# Altium project myPLC.PrjPcb (part 1 of 2)
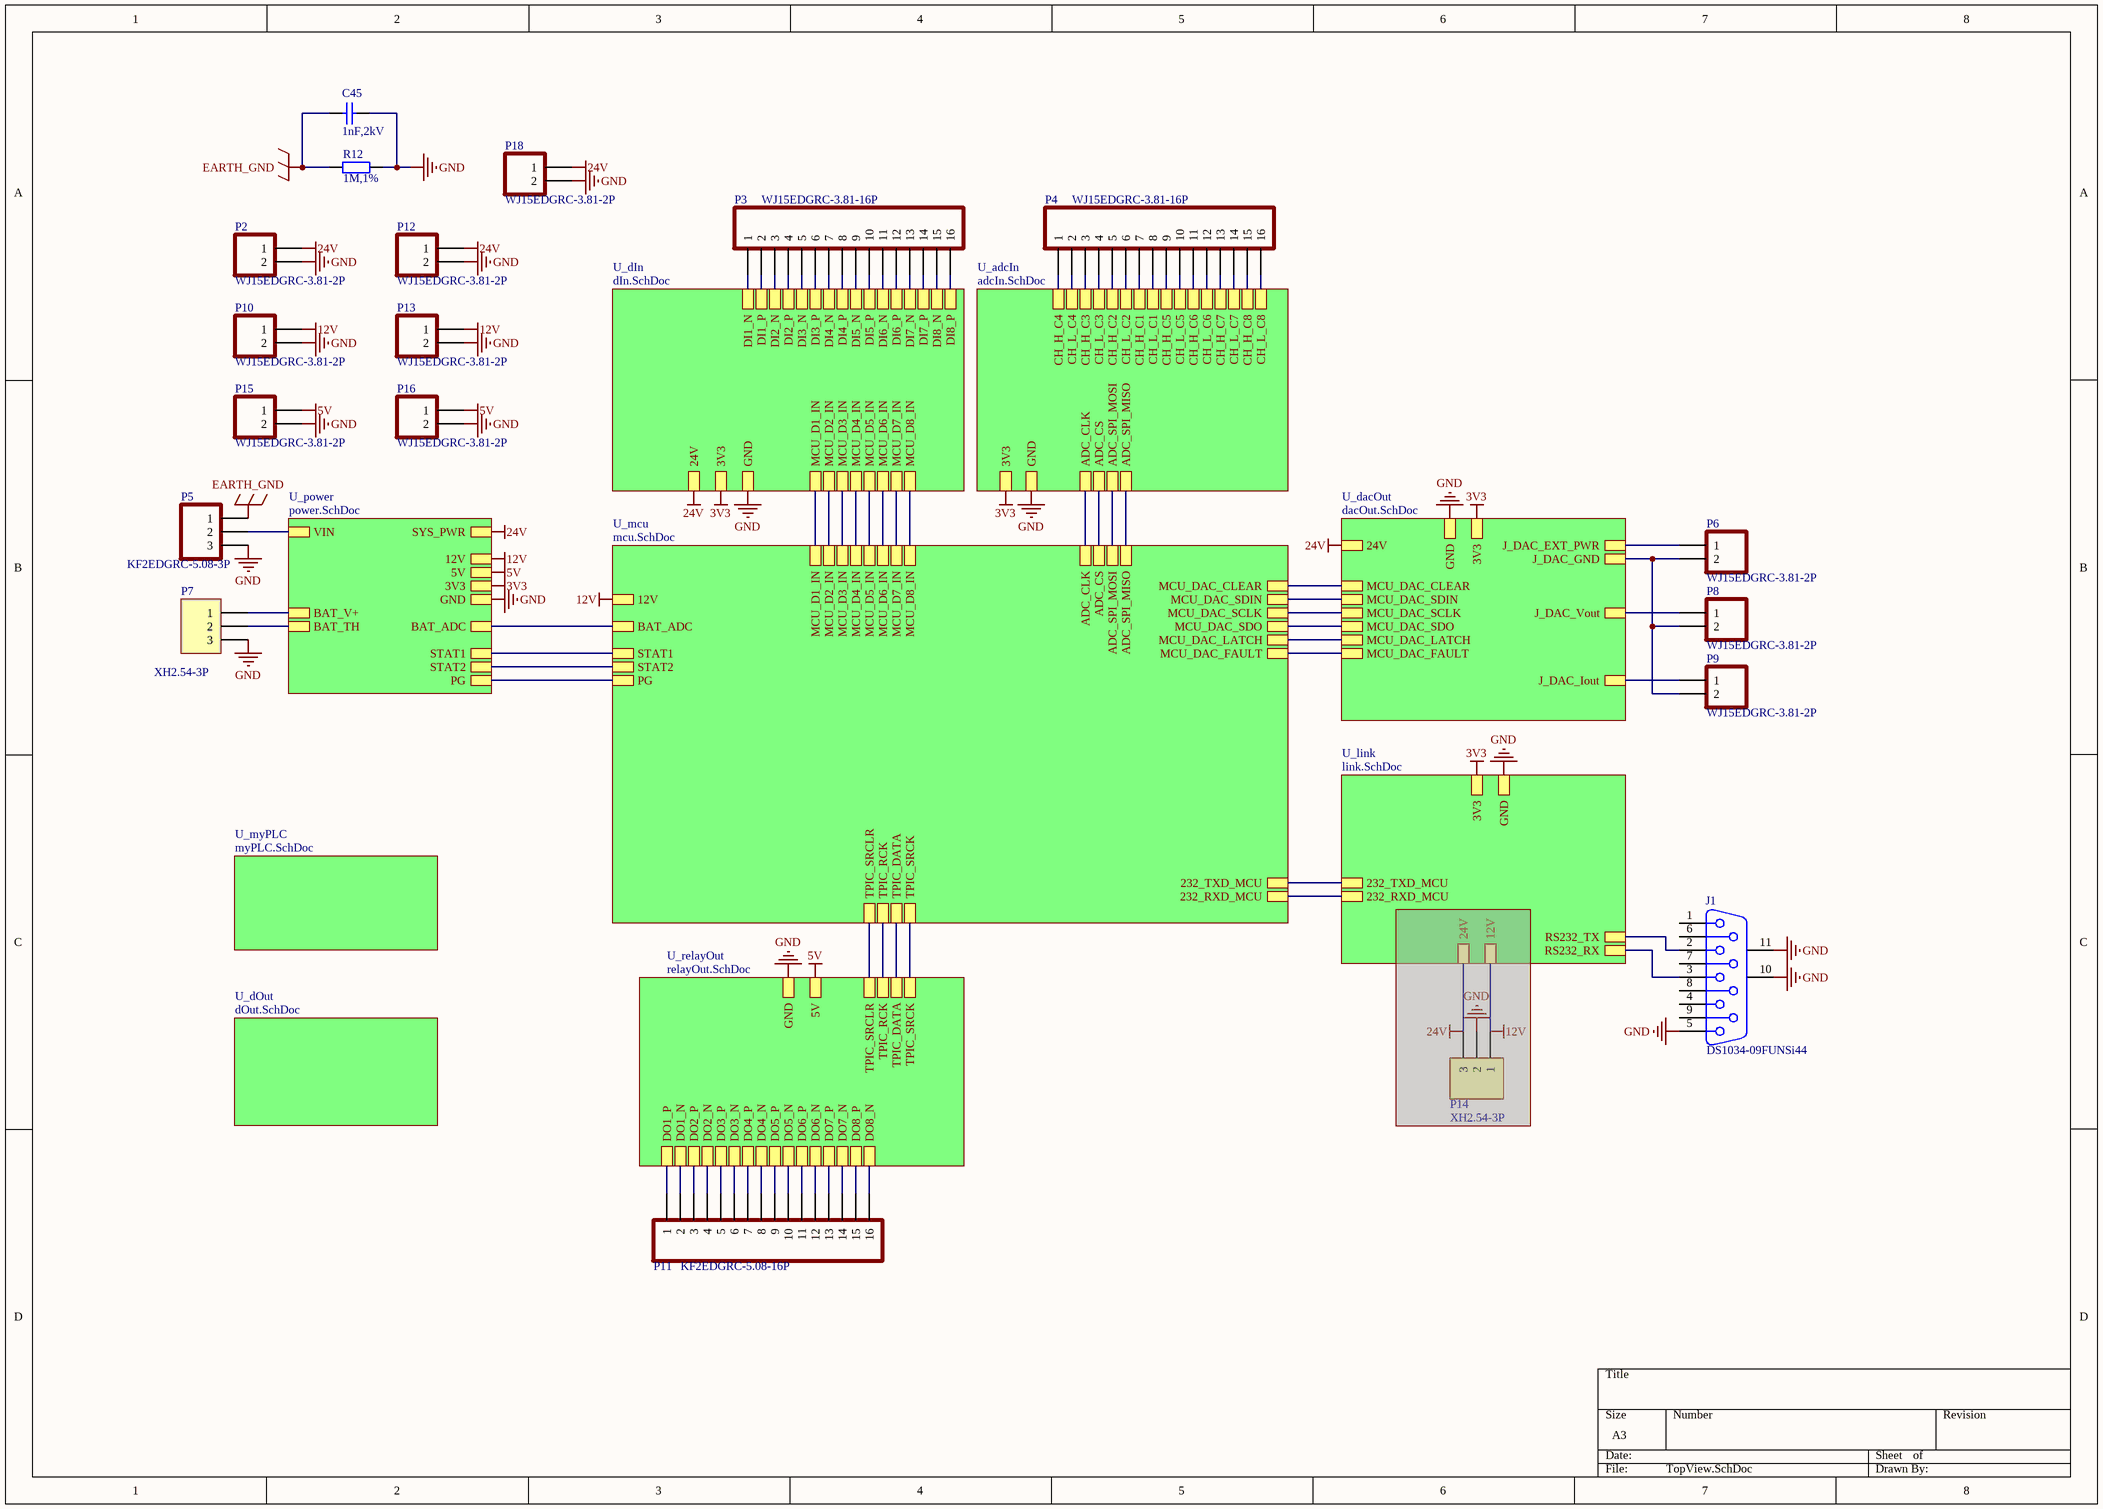
[diagram p0: TopView.SchDoc]
14 sheets, 401 parts. Net scope: hierarchical (ports join the sheet entries above them; power ports are global).
Board file: PCB1.PcbDoc
Sheets:
  TopView.SchDoc
    U_adcIn = adcIn.SchDoc
      A1 = subADCIn.SchDoc
      A2 = subADCIn.SchDoc
      A3 = subADCIn.SchDoc
      A4 = subADCIn.SchDoc
      A5 = subADCIn.SchDoc
      A6 = subADCIn.SchDoc
      A7 = subADCIn.SchDoc
      A8 = subADCIn.SchDoc
    U_dacOut = dacOut.SchDoc
      AOUT1 = subDACOut.SchDoc
    U_dIn = dIn.SchDoc
      DIN1 = subDIn.SchDoc
      DIN2 = subDIn.SchDoc
      DIN3 = subDIn.SchDoc
      DIN4 = subDIn.SchDoc
      DIN5 = subDIn.SchDoc
      DIN6 = subDIn.SchDoc
      DIN7 = subDIn.SchDoc
      DIN8 = subDIn.SchDoc
    U_dOut = dOut.SchDoc
    U_link = link.SchDoc
    U_mcu = mcu.SchDoc
    U_relayOut = relayOut.SchDoc
      DO1 = subRelayOut.SchDoc
      DO2 = subRelayOut.SchDoc
      DO3 = subRelayOut.SchDoc
      DO4 = subRelayOut.SchDoc
      DO5 = subRelayOut.SchDoc
      DO6 = subRelayOut.SchDoc
      DO7 = subRelayOut.SchDoc
      DO8 = subRelayOut.SchDoc
    U_myPLC = myPLC.SchDoc
    U_power = power.SchDoc

## Sheet TopView.SchDoc
size A3

### Parts
(Parts that share a designator on the sheet are numbered #1, #2 ... from top to bottom, then left to right.)
C45  1nF,2kV  [C1206]
J1#1  DS1034-09FUNSi44  [DSUB-TH_2-5747706-0]
P2#1  WJ15EDGRC-3.81-2P  [CONN-TH_2P-P3.81_WJ15EDGRC-3.81-2P]
P3  WJ15EDGRC-3.81-16P  [CONN-TH_16P-P3.81_WJ15EDGRC-3.81-16P]
P4  WJ15EDGRC-3.81-16P  [CONN-TH_16P-P3.81_WJ15EDGRC-3.81-16P]
P5  KF2EDGRC-5.08-3P  [CONN-TH_3P-P5.08_KF2EDGRC-5.08-3P]
P6  WJ15EDGRC-3.81-2P  [CONN-TH_2P-P3.81_WJ15EDGRC-3.81-2P]
P7  XH2.54-3P  [XH2.54-3P;弯角;]
P8  WJ15EDGRC-3.81-2P  [CONN-TH_2P-P3.81_WJ15EDGRC-3.81-2P]
P9  WJ15EDGRC-3.81-2P  [CONN-TH_2P-P3.81_WJ15EDGRC-3.81-2P]
P10  WJ15EDGRC-3.81-2P  [CONN-TH_2P-P3.81_WJ15EDGRC-3.81-2P]
P11  KF2EDGRC-5.08-16P  [CONN-TH_16P-P5.08_KF2EDGRC-5.08-16P]
P12  WJ15EDGRC-3.81-2P  [CONN-TH_2P-P3.81_WJ15EDGRC-3.81-2P]
P13  WJ15EDGRC-3.81-2P  [CONN-TH_2P-P3.81_WJ15EDGRC-3.81-2P]
P14#1  XH2.54-3P  [XH2.54-3P-直角]  (masked out: inside a compile mask, not in the netlist)
P15  WJ15EDGRC-3.81-2P  [CONN-TH_2P-P3.81_WJ15EDGRC-3.81-2P]
P16  WJ15EDGRC-3.81-2P  [CONN-TH_2P-P3.81_WJ15EDGRC-3.81-2P]
P18  WJ15EDGRC-3.81-2P  [CONN-TH_2P-P3.81_WJ15EDGRC-3.81-2P]
R12  1M,1%  [R1206]

### Sub-sheets
U_adcIn = adcIn.SchDoc: ADC_SPI_MISO, ADC_SPI_MOSI, ADC_CS, ADC_CLK, 3V3, GND, CH_L_C8, CH_L_C3, CH_L_C1, CH_H_C7, CH_H_C2, CH_H_C3, CH_L_C4, CH_L_C6, CH_L_C7, CH_L_C5, CH_H_C4, CH_H_C1, CH_H_C5, CH_H_C8, CH_L_C2, CH_H_C6
U_dacOut = dacOut.SchDoc: 24V, MCU_DAC_CLEAR, MCU_DAC_SDIN, MCU_DAC_SCLK, 3V3, J_DAC_Iout, J_DAC_Vout, MCU_DAC_SDO, J_DAC_GND, MCU_DAC_FAULT, J_DAC_EXT_PWR, MCU_DAC_LATCH, GND
U_dIn = dIn.SchDoc: MCU_D1_IN, MCU_D2_IN, MCU_D3_IN, MCU_D4_IN, MCU_D5_IN, MCU_D6_IN, MCU_D7_IN, MCU_D8_IN, GND, 24V, 3V3, DI1_N, DI1_P, DI2_N, DI2_P, DI3_N, DI3_P, DI4_N, DI4_P, DI5_N, DI5_P, DI6_N, DI6_P, DI7_N, DI7_P, DI8_N, DI8_P
U_dOut = dOut.SchDoc: no entries
U_link = link.SchDoc: GND, RS232_TX, RS232_RX, 232_TXD_MCU, 232_RXD_MCU, 3V3, 24V, 12V
U_mcu = mcu.SchDoc: ADC_SPI_MISO, ADC_SPI_MOSI, ADC_CS, ADC_CLK, MCU_D1_IN, MCU_D2_IN, MCU_D3_IN, MCU_D4_IN, MCU_D5_IN, MCU_D6_IN, MCU_D7_IN, MCU_D8_IN, TPIC_SRCLR, TPIC_RCK, TPIC_DATA, TPIC_SRCK, 232_TXD_MCU, 232_RXD_MCU, MCU_DAC_CLEAR, MCU_DAC_SDIN, MCU_DAC_SCLK, MCU_DAC_SDO, MCU_DAC_FAULT, MCU_DAC_LATCH, 12V, BAT_ADC, STAT1, STAT2, PG
U_myPLC = myPLC.SchDoc: no entries
U_power = power.SchDoc: GND, 12V, 5V, 3V3, VIN, BAT_V+, BAT_TH, BAT_ADC, SYS_PWR, STAT1, STAT2, PG
U_relayOut = relayOut.SchDoc: DO1_P, DO2_P, DO3_P, DO4_P, DO5_P, DO6_P, DO7_P, DO8_P, DO1_N, DO2_N, DO3_N, DO4_N, DO5_N, DO6_N, DO7_N, DO8_N, GND, 5V, TPIC_SRCLR, TPIC_RCK, TPIC_DATA, TPIC_SRCK

### Nets
3V3: sheet U_adcIn/3V3, sheet U_dacOut/3V3, sheet U_dIn/3V3, sheet U_link/3V3, sheet U_power/3V3
5V: P15.1 P16.1 ; sheet U_relayOut/5V, sheet U_power/5V
12V: P10.1 P13.1 ; sheet U_mcu/12V, sheet U_power/12V
24V: P2#1.1 P12.1 P18.1 ; sheet U_dacOut/24V, sheet U_dIn/24V, sheet U_power/SYS_PWR
EARTH_GND: C45.1 P5.1 R12.2
EXT_DAC_VCC: P6.1 ; sheet U_dacOut/J_DAC_EXT_PWR
GND: C45.2 J1#1.5 J1#1.10(MH1) J1#1.11(MH2) P2#1.2 P5.3 P7.3 P10.2 P12.2 P13.2 P15.2 P16.2 P18.2 R12.1 ; sheet U_adcIn/GND, sheet U_dacOut/GND, sheet U_dIn/GND, sheet U_link/GND, sheet U_relayOut/GND, sheet U_power/GND
ISO_DAC_GND: P6.2 P8.2 P9.2 ; sheet U_dacOut/J_DAC_GND
VIN: P5.2 ; sheet U_power/VIN
ADC1_IN0: sheet U_mcu/BAT_ADC, sheet U_power/BAT_ADC
ADC_CLK: sheet U_adcIn/ADC_CLK, sheet U_mcu/ADC_CLK
ADC_CS: sheet U_adcIn/ADC_CS, sheet U_mcu/ADC_CS
ADC_SPI_MISO: sheet U_adcIn/ADC_SPI_MISO, sheet U_mcu/ADC_SPI_MISO
ADC_SPI_MOSI: sheet U_adcIn/ADC_SPI_MOSI, sheet U_mcu/ADC_SPI_MOSI
CH_H_C1: P4.7 ; sheet U_adcIn/CH_H_C1
CH_H_C2: P4.5 ; sheet U_adcIn/CH_H_C2
CH_H_C3: P4.3 ; sheet U_adcIn/CH_H_C3
CH_H_C4: P4.1 ; sheet U_adcIn/CH_H_C4
CH_H_C5: P4.9 ; sheet U_adcIn/CH_H_C5
CH_H_C6: P4.11 ; sheet U_adcIn/CH_H_C6
CH_H_C7: P4.13 ; sheet U_adcIn/CH_H_C7
CH_H_C8: P4.15 ; sheet U_adcIn/CH_H_C8
CH_L_C1: P4.8 ; sheet U_adcIn/CH_L_C1
CH_L_C2: P4.6 ; sheet U_adcIn/CH_L_C2
CH_L_C3: P4.4 ; sheet U_adcIn/CH_L_C3
CH_L_C4: P4.2 ; sheet U_adcIn/CH_L_C4
CH_L_C5: P4.10 ; sheet U_adcIn/CH_L_C5
CH_L_C6: P4.12 ; sheet U_adcIn/CH_L_C6
CH_L_C7: P4.14 ; sheet U_adcIn/CH_L_C7
CH_L_C8: P4.16 ; sheet U_adcIn/CH_L_C8
D1_IN: sheet U_dIn/MCU_D1_IN, sheet U_mcu/MCU_D1_IN
D2_IN: sheet U_dIn/MCU_D2_IN, sheet U_mcu/MCU_D2_IN
D3_IN: sheet U_dIn/MCU_D3_IN, sheet U_mcu/MCU_D3_IN
D4_IN: sheet U_dIn/MCU_D4_IN, sheet U_mcu/MCU_D4_IN
D5_IN: sheet U_dIn/MCU_D5_IN, sheet U_mcu/MCU_D5_IN
D6_IN: sheet U_dIn/MCU_D6_IN, sheet U_mcu/MCU_D6_IN
D7_IN: sheet U_dIn/MCU_D7_IN, sheet U_mcu/MCU_D7_IN
D8_IN: sheet U_dIn/MCU_D8_IN, sheet U_mcu/MCU_D8_IN
DI_N1: P3.1 ; sheet U_dIn/DI1_N
DI_N2: P3.3 ; sheet U_dIn/DI2_N
DI_N3: P3.5 ; sheet U_dIn/DI3_N
DI_N4: P3.7 ; sheet U_dIn/DI4_N
DI_N5: P3.9 ; sheet U_dIn/DI5_N
DI_N6: P3.11 ; sheet U_dIn/DI6_N
DI_N7: P3.13 ; sheet U_dIn/DI7_N
DI_N8: P3.15 ; sheet U_dIn/DI8_N
DI_P1: P3.2 ; sheet U_dIn/DI1_P
DI_P2: P3.4 ; sheet U_dIn/DI2_P
DI_P3: P3.6 ; sheet U_dIn/DI3_P
DI_P4: P3.8 ; sheet U_dIn/DI4_P
DI_P5: P3.10 ; sheet U_dIn/DI5_P
DI_P6: P3.12 ; sheet U_dIn/DI6_P
DI_P7: P3.14 ; sheet U_dIn/DI7_P
DI_P8: P3.16 ; sheet U_dIn/DI8_P
DO_N1: P11.2 ; sheet U_relayOut/DO1_N
DO_N2: P11.4 ; sheet U_relayOut/DO2_N
DO_N3: P11.6 ; sheet U_relayOut/DO3_N
DO_N4: P11.8 ; sheet U_relayOut/DO4_N
DO_N5: P11.10 ; sheet U_relayOut/DO5_N
DO_N6: P11.12 ; sheet U_relayOut/DO6_N
DO_N7: P11.14 ; sheet U_relayOut/DO7_N
DO_N8: P11.16 ; sheet U_relayOut/DO8_N
DO_P1: P11.1 ; sheet U_relayOut/DO1_P
DO_P2: P11.3 ; sheet U_relayOut/DO2_P
DO_P3: P11.5 ; sheet U_relayOut/DO3_P
DO_P4: P11.7 ; sheet U_relayOut/DO4_P
DO_P5: P11.9 ; sheet U_relayOut/DO5_P
DO_P6: P11.11 ; sheet U_relayOut/DO6_P
DO_P7: P11.13 ; sheet U_relayOut/DO7_P
DO_P8: P11.15 ; sheet U_relayOut/DO8_P
PG: sheet U_mcu/PG, sheet U_power/PG
SPI2_MISO: sheet U_dacOut/MCU_DAC_SDO, sheet U_mcu/MCU_DAC_SDO
SPI2_MOSI: sheet U_dacOut/MCU_DAC_SDIN, sheet U_mcu/MCU_DAC_SDIN
SPI2_SCK: sheet U_dacOut/MCU_DAC_SCLK, sheet U_mcu/MCU_DAC_SCLK
STAT1: sheet U_mcu/STAT1, sheet U_power/STAT1
STAT2: sheet U_mcu/STAT2, sheet U_power/STAT2
TPIC_DATA: sheet U_mcu/TPIC_DATA, sheet U_relayOut/TPIC_DATA
TPIC_RCK: sheet U_mcu/TPIC_RCK, sheet U_relayOut/TPIC_RCK
TPIC_SRCK: sheet U_mcu/TPIC_SRCK, sheet U_relayOut/TPIC_SRCK
TPIC_SRCLR: sheet U_mcu/TPIC_SRCLR, sheet U_relayOut/TPIC_SRCLR
USART2_RX: sheet U_link/232_RXD_MCU, sheet U_mcu/232_RXD_MCU
USART2_TX: sheet U_link/232_TXD_MCU, sheet U_mcu/232_TXD_MCU
NetC69_1: P7.1 ; sheet U_power/BAT_V+
NetD14_2: P8.1 ; sheet U_dacOut/J_DAC_Vout
NetD16_2: P9.1 ; sheet U_dacOut/J_DAC_Iout
NetJ1#1_2: J1#1.2 ; sheet U_link/RS232_TX
NetJ1#1_3: J1#1.3 ; sheet U_link/RS232_RX
NetP7_2: P7.2 ; sheet U_power/BAT_TH
NetU2_95: sheet U_dacOut/MCU_DAC_LATCH, sheet U_mcu/MCU_DAC_LATCH
NetU2_96: sheet U_dacOut/MCU_DAC_CLEAR, sheet U_mcu/MCU_DAC_CLEAR
NetU2_97: sheet U_dacOut/MCU_DAC_FAULT, sheet U_mcu/MCU_DAC_FAULT

Not connected (* = marked no-connect by the designer): J1#1 1 4 6 7 8 9

### Library data of the parts
C45 = 无极电容: Value: 104, 16V; Type: 贴片电容
J1#1 = D Connector 9: Receptacle Assembly, 9 Position, Right Angle; PackageDocument: O; Positions: 9; Published: 15-Jun-2001; LatestRevisionDate: 17-Jul-2002; LatestRevisionNote: Re-released for DXP Platform.; DatasheetDocument: 1-Sep-1999; PackageReference: 788750; Publisher: Altium Limited; Orientation: Right Angle; Gender: Receptacle
P5 = WJ15EDGRC-3.81-3P: LatestRevisionNote: Re-released for DXP Platform.
P7 = Header 3: Header, 3-Pin; LatestRevisionDate: 17-Jul-2002; LatestRevisionNote: Re-released for DXP Platform.; Publisher: Altium Limited
P11 = WJ15EDGRC-3.81-16P: LatestRevisionNote: Re-released for DXP Platform.
P14#1 = C3-3Pin: C3连接器插座, 3-Pin; name: C3连接器
R12 = 电阻: Value: 3.3K, 10%; Type: 贴片电阻
P2#1 P6 P8-P10 P12 P13 P15 P16 P18 = WJ15EDGRC-3.81-2P: LatestRevisionNote: Re-released for DXP Platform.
P3 P4 = WJ15EDGRC-3.81-16P: LatestRevisionNote: Re-released for DXP Platform.

## Sheet adcIn.SchDoc
size A4
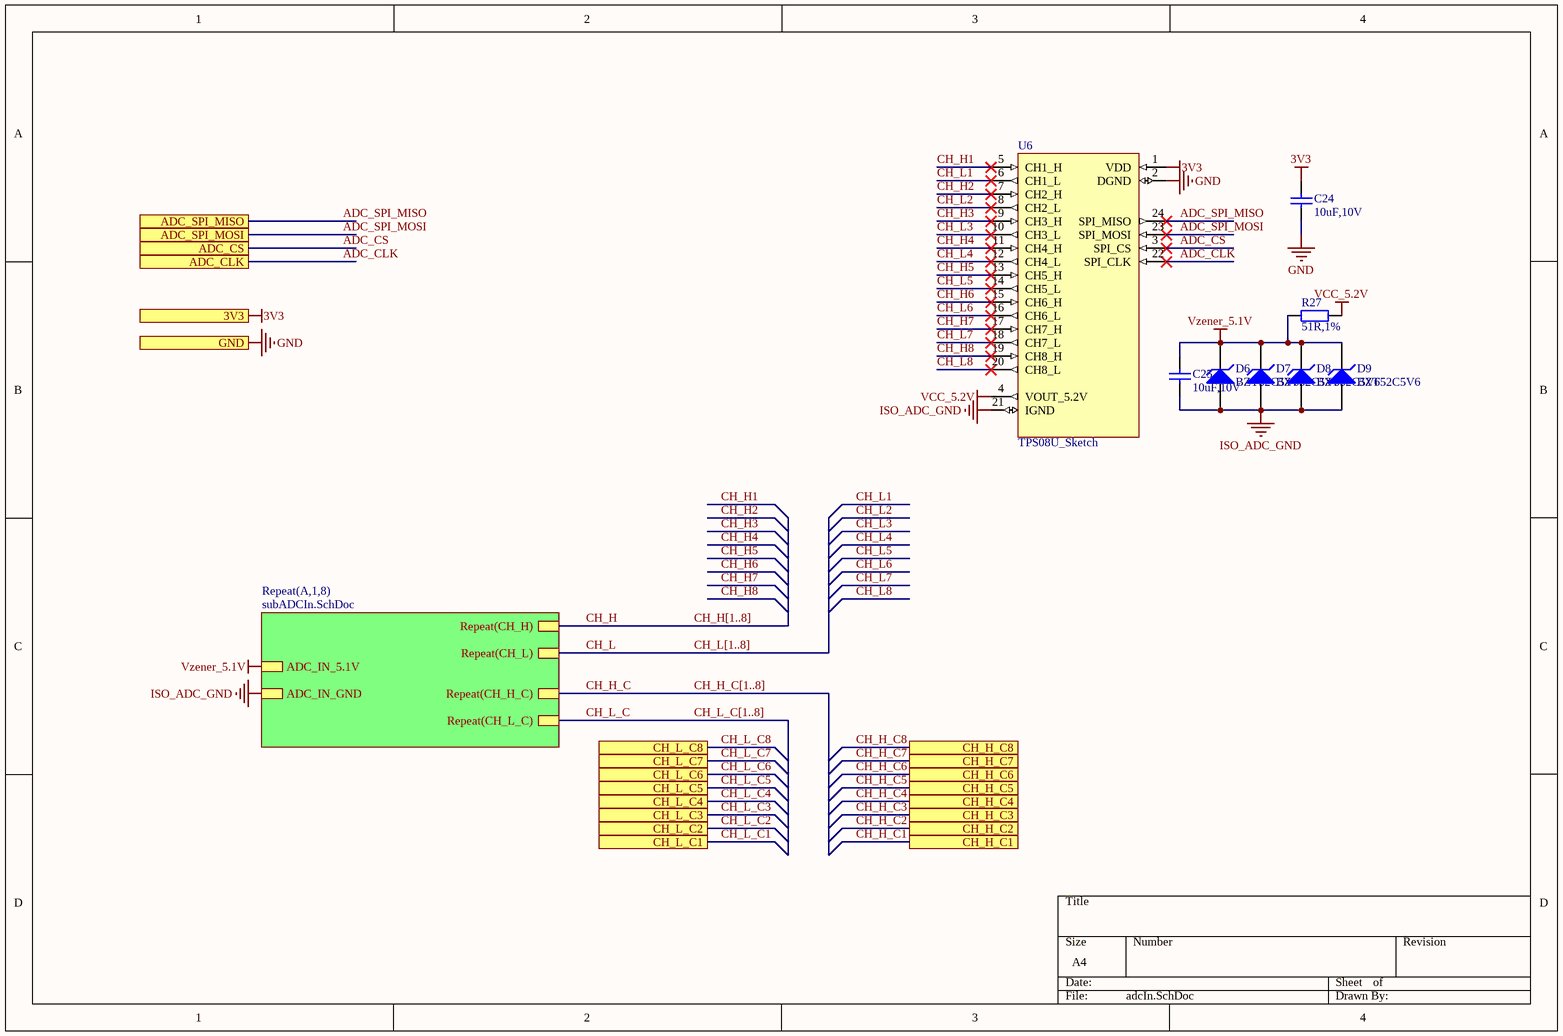
[diagram p1: adcIn.SchDoc]

### Parts
(Parts that share a designator on the sheet are numbered #1, #2 ... from top to bottom, then left to right.)
C24  10uF,10V  [C0603]
C25  10uF,10V  [C0603]
D6  BZT52C5V6  [SOD-123]
D7  BZT52C5V6  [SOD-123]
D8#1  BZT52C5V6  [SOD-123]
D9#1  BZT52C5V6  [SOD-123]
R27  51R,1%  [R0603]
U6  TPS08U_Sketch  [TPS08U]

### Sub-sheets
Repeat(A,1,8) = subADCIn.SchDoc: Repeat(CH_H), Repeat(CH_L), ADC_IN_5.1V, ADC_IN_GND, Repeat(CH_L_C), Repeat(CH_H_C)

### Ports
3V3, ADC_CLK, ADC_CS, ADC_SPI_MISO, ADC_SPI_MOSI, CH_H_C1, CH_H_C2, CH_H_C3, CH_H_C4, CH_H_C5, CH_H_C6, CH_H_C7, CH_H_C8, CH_L_C1, CH_L_C2, CH_L_C3, CH_L_C4, CH_L_C5, CH_L_C6, CH_L_C7, CH_L_C8, GND

### Nets
3V3: C24.1 U6.1(VDD) ; port 3V3
GND: C24.2 U6.2(DGND) ; port GND
ISO_ADC_GND: C25.2 D6.1(A) D7.1(A) D8#1.1(A) D9#1.1(A) U6.21(IGND) ; sheet Repeat(A,1,8)/ADC_IN_GND  [project net ADC_IN_GND]
VCC_5.2V: R27.1 U6.4(VOUT_5.2V)
Vzener_5.1V: C25.1 D6.2(K) D7.2(K) D8#1.2(K) D9#1.2(K) R27.2 ; sheet Repeat(A,1,8)/ADC_IN_5.1V  [project net ADC_IN_5.1V]
ADC_CLK: U6.22(SPI_CLK) ; port ADC_CLK
ADC_CS: U6.3(SPI_CS) ; port ADC_CS
ADC_SPI_MISO: U6.24(SPI_MISO) ; port ADC_SPI_MISO
ADC_SPI_MOSI: U6.23(SPI_MOSI) ; port ADC_SPI_MOSI
CH_H: sheet Repeat(A,1,8)/Repeat(CH_H)
CH_H1: U6.5(CH1_H)
CH_H2: U6.7(CH2_H)
CH_H3: U6.9(CH3_H)
CH_H4: U6.11(CH4_H)
CH_H5: U6.13(CH5_H)
CH_H6: U6.15(CH6_H)
CH_H7: U6.17(CH7_H)
CH_H8: U6.19(CH8_H)
CH_H_C: sheet Repeat(A,1,8)/Repeat(CH_H_C)
CH_L: sheet Repeat(A,1,8)/Repeat(CH_L)
CH_L1: U6.6(CH1_L)
CH_L2: U6.8(CH2_L)
CH_L3: U6.10(CH3_L)
CH_L4: U6.12(CH4_L)
CH_L5: U6.14(CH5_L)
CH_L6: U6.16(CH6_L)
CH_L7: U6.18(CH7_L)
CH_L8: U6.20(CH8_L)
CH_L_C: sheet Repeat(A,1,8)/Repeat(CH_L_C)

### Buses and harness runs
bus CH_H[1..8]
bus CH_H_C[1..8]
bus CH_L[1..8]
bus CH_L_C[1..8]

### Library data of the parts
C24 C25 = CAP: Capacitor; Fitted: True
D6 D7 D8#1 D9#1 = BZT52C5V6: Surface Mount Zener Diode; Published: 8-Jun-2000; LatestRevisionDate: 17-Jul-2002; LatestRevisionNote: Re-released for DXP Platform.; DatasheetDocument: REV. L-2; PackageReference: SOD-123; Publisher: Altium Limited; ComponentLink1Description: Manufacturer Link; ComponentLink1URL: http://www.vishay.com/
R27 = 电阻: Value: 3.3K, 10%; Type: 贴片电阻

## Sheet subADCIn.SchDoc
size A4
Used 8 times, as channels U_adcIn/A1, U_adcIn/A2, U_adcIn/A3, U_adcIn/A4, U_adcIn/A5, U_adcIn/A6, U_adcIn/A7, U_adcIn/A8. Parts and nets are listed once, with the designators drawn on the sheet.
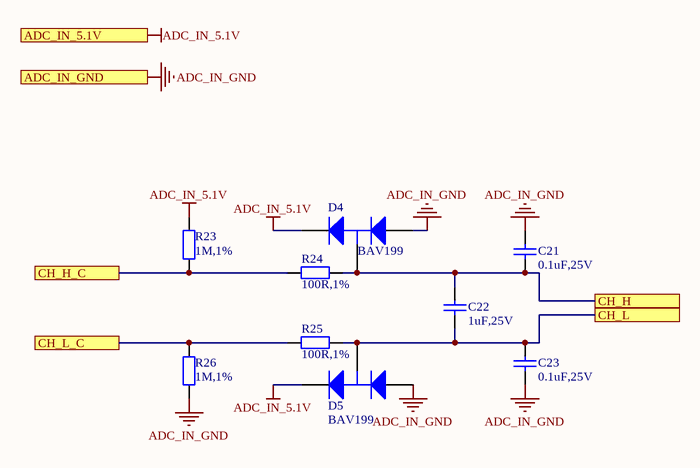
[diagram p2: subADCIn.SchDoc]

### Parts
C21  0.1uF,25V  [C0603]
C22  1uF,25V  [C0603]
C23  0.1uF,25V  [C0603]
D4  BAV199  [SOT-23]
D5  BAV199  [SOT-23]
R23  1M,1%  [R0603]
R24  100R,1%  [R0603]
R25  100R,1%  [R0603]
R26  1M,1%  [R0603]

### Ports
ADC_IN_5.1V, ADC_IN_GND, CH_H, CH_H_C, CH_L, CH_L_C

### Nets
ADC_IN_5.1V: D4.2(K) D5.2(K) R23.2 ; port ADC_IN_5.1V
ADC_IN_GND: C21.1 C23.2 D4.1(A) D5.1(A) R26.2 ; port ADC_IN_GND
CH_H: C21.2 C22.1 D4.3(C) R24.1 ; port CH_H
CH_H_C: R23.1 R24.2 ; port CH_H_C
CH_L: C22.2 C23.1 D5.3(C) R25.1 ; port CH_L
CH_L_C: R25.2 R26.1 ; port CH_L_C

### Channels
U_adcIn/A1: designators end in _A1; ports ADC_IN_5.1V=ADC_IN_5.1V ADC_IN_GND=ADC_IN_GND CH_H=CH_H1 CH_H_C=CH_H_C1 CH_L=CH_L1 CH_L_C=CH_L_C1
U_adcIn/A2: designators end in _A2; ports ADC_IN_5.1V=ADC_IN_5.1V ADC_IN_GND=ADC_IN_GND CH_H=CH_H2 CH_H_C=CH_H_C2 CH_L=CH_L2 CH_L_C=CH_L_C2
U_adcIn/A3: designators end in _A3; ports ADC_IN_5.1V=ADC_IN_5.1V ADC_IN_GND=ADC_IN_GND CH_H=CH_H3 CH_H_C=CH_H_C3 CH_L=CH_L3 CH_L_C=CH_L_C3
U_adcIn/A4: designators end in _A4; ports ADC_IN_5.1V=ADC_IN_5.1V ADC_IN_GND=ADC_IN_GND CH_H=CH_H4 CH_H_C=CH_H_C4 CH_L=CH_L4 CH_L_C=CH_L_C4
U_adcIn/A5: designators end in _A5; ports ADC_IN_5.1V=ADC_IN_5.1V ADC_IN_GND=ADC_IN_GND CH_H=CH_H5 CH_H_C=CH_H_C5 CH_L=CH_L5 CH_L_C=CH_L_C5
U_adcIn/A6: designators end in _A6; ports ADC_IN_5.1V=ADC_IN_5.1V ADC_IN_GND=ADC_IN_GND CH_H=CH_H6 CH_H_C=CH_H_C6 CH_L=CH_L6 CH_L_C=CH_L_C6
U_adcIn/A7: designators end in _A7; ports ADC_IN_5.1V=ADC_IN_5.1V ADC_IN_GND=ADC_IN_GND CH_H=CH_H7 CH_H_C=CH_H_C7 CH_L=CH_L7 CH_L_C=CH_L_C7
U_adcIn/A8: designators end in _A8; ports ADC_IN_5.1V=ADC_IN_5.1V ADC_IN_GND=ADC_IN_GND CH_H=CH_H8 CH_H_C=CH_H_C8 CH_L=CH_L8 CH_L_C=CH_L_C8

### Library data of the parts
C21-C23 = CAP: Capacitor; Fitted: True
D4 D5 = BAV199: Silicon Low-Leakage Diode Array connected in series; Published: 8-Jun-2000; DatasheetDocument: Oct-1999; PackageDocument: Sep-2001; PackageReference: SOT-23; Publisher: Altium Limited; ComponentLink1Description: Manufacturer Link; ComponentLink1URL: http://www.infineon.com/; ComponentLink2Description: Datasheet; ComponentLink2URL: http://www.infineon.com/upload/Document/cmc_upload/documents/009/441/bav199series_1.pdf
R23-R26 = 电阻: Value: 3.3K, 10%; Type: 贴片电阻

## Sheet dacOut.SchDoc
size A4
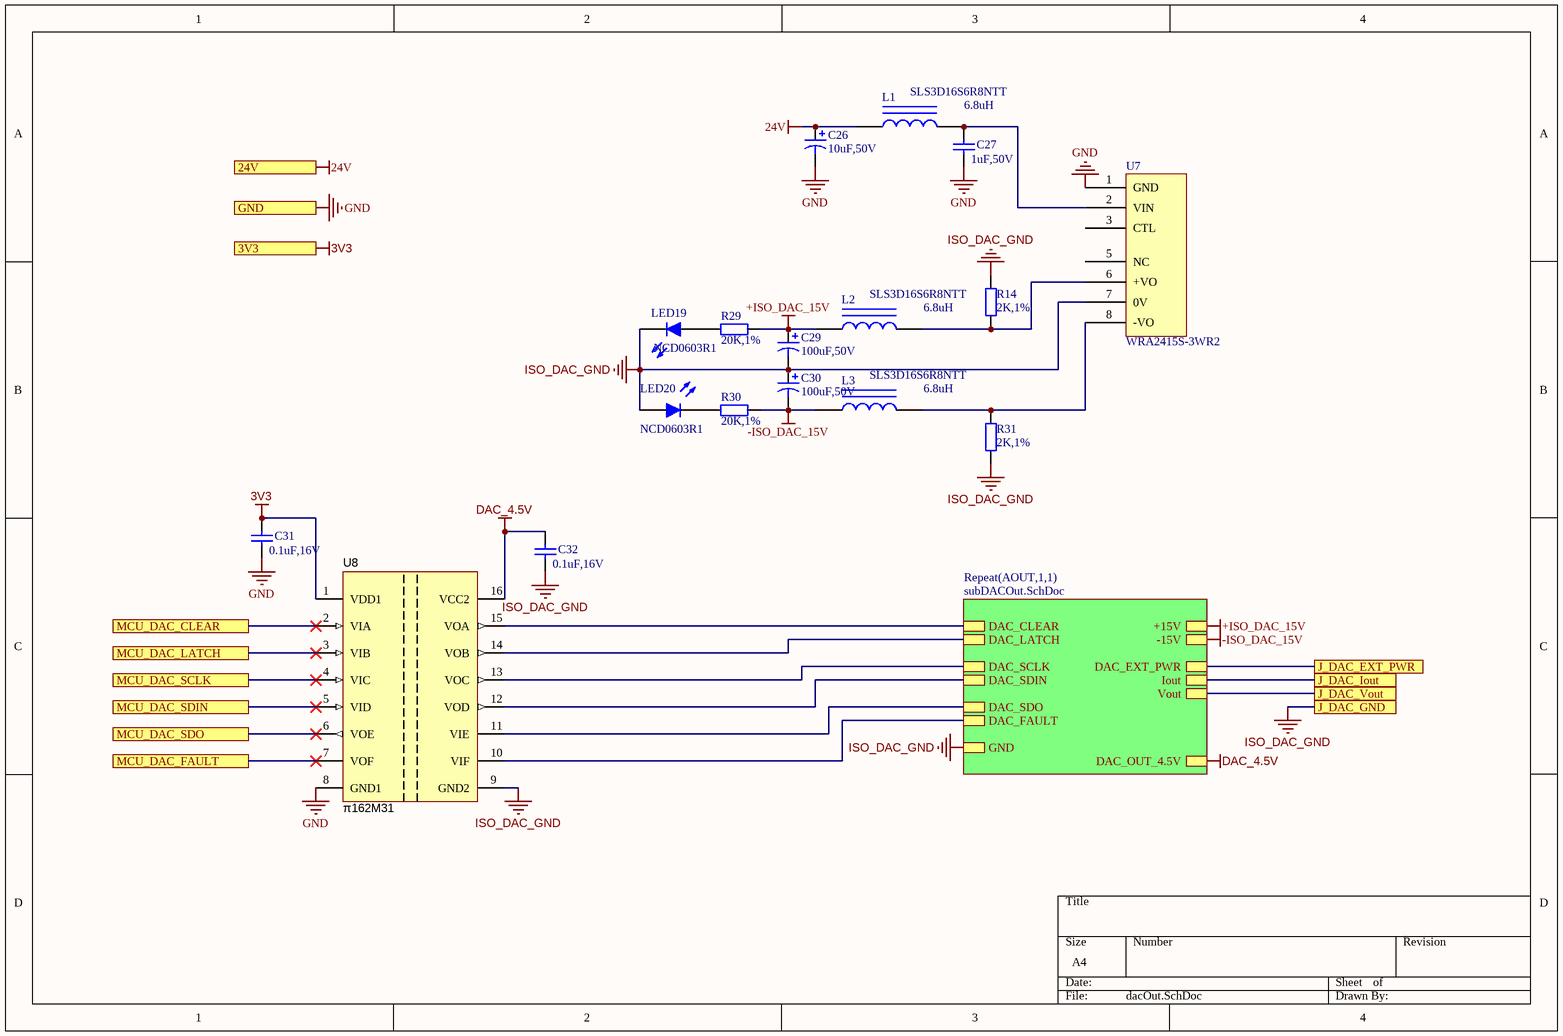
[diagram p3: dacOut.SchDoc]

### Parts
C26  10uF,50V  [CAP-TH_BD5.0-P2.00-D0.8-FD]
C27  1uF,50V  [C0603]
C29  100uF,50V  [CAP-TH_BD6.3-P2.50-D1.0-FD]
C30  100uF,50V  [CAP-TH_BD6.3-P2.50-D1.0-FD]
C31  0.1uF,16V  [C0603]
C32  0.1uF,16V  [C0603]
L1  SLS3D16S6R8NTT  value 6.8uH  [IND-SMD_L4.0-W4.0_SLS3DXX]
L2  SLS3D16S6R8NTT  value 6.8uH  [IND-SMD_L4.0-W4.0_SLS3DXX]
L3  SLS3D16S6R8NTT  value 6.8uH  [IND-SMD_L4.0-W4.0_SLS3DXX]
LED19  NCD0603R1  [LED0603-RD]
LED20  NCD0603R1  [LED0603-RD]
R14  2K,1%  [R0603]
R29  20K,1%  [R0603]
R30  20K,1%  [R0603]
R31  2K,1%  [R0603]
U7  WRA2415S-3WR2  [PWRM-TH_WRA2415S-3WR2]
U8  π162M31  [SOIC-16_L9.9-W3.9-P1.27-LS6.0-BL]

### Sub-sheets
Repeat(AOUT,1,1) = subDACOut.SchDoc: GND, Vout, -15V, +15V, DAC_EXT_PWR, Iout, DAC_OUT_4.5V, DAC_CLEAR, DAC_LATCH, DAC_FAULT, DAC_SDO, DAC_SCLK, DAC_SDIN

### Ports
3V3, 24V, GND, J_DAC_EXT_PWR, J_DAC_GND, J_DAC_Iout, J_DAC_Vout, MCU_DAC_CLEAR, MCU_DAC_FAULT, MCU_DAC_LATCH, MCU_DAC_SCLK, MCU_DAC_SDIN, MCU_DAC_SDO

### Nets
3V3: C31.2 U8.1(VDD1) ; port 3V3
24V: C26.1 L1.1 ; port 24V
+ISO_DAC_15V: C29.1 L2.1 R29.2 ; sheet Repeat(AOUT,1,1)/+15V  [project net +DAC_15V]
-ISO_DAC_15V: C30.2 L3.1 R30.2 ; sheet Repeat(AOUT,1,1)/-15V  [project net -DAC_15V]
DAC_4.5V: C32.2 U8.16(VCC2) ; sheet Repeat(AOUT,1,1)/DAC_OUT_4.5V
EXT_DAC_VCC: port J_DAC_EXT_PWR, sheet Repeat(AOUT,1,1)/DAC_EXT_PWR
GND: C26.2 C27.1 C31.1 U7.1(GND) U8.8(GND1) ; port GND
ISO_DAC_GND: C29.2 C30.1 C32.1 LED19.1(K) LED20.2(A) R14.2 R31.1 U7.7(0V) U8.9(GND2) ; port J_DAC_GND, sheet Repeat(AOUT,1,1)/GND
DAC_CLEAR: U8.15(VOA) ; sheet Repeat(AOUT,1,1)/DAC_CLEAR
DAC_FAULT: U8.10(VIF) ; sheet Repeat(AOUT,1,1)/DAC_FAULT
DAC_LATCH: U8.14(VOB) ; sheet Repeat(AOUT,1,1)/DAC_LATCH
DAC_SCLK: U8.13(VOC) ; sheet Repeat(AOUT,1,1)/DAC_SCLK
DAC_SDIN: U8.12(VOD) ; sheet Repeat(AOUT,1,1)/DAC_SDIN
DAC_SDO: U8.11(VIE) ; sheet Repeat(AOUT,1,1)/DAC_SDO
SPI2_MISO: U8.6(VOE) ; port MCU_DAC_SDO
SPI2_MOSI: U8.5(VID) ; port MCU_DAC_SDIN
SPI2_SCK: U8.4(VIC) ; port MCU_DAC_SCLK
NetC27_2: C27.2 L1.2 U7.2(VIN)
NetD14_2: port J_DAC_Vout, sheet Repeat(AOUT,1,1)/Vout
NetD16_2: port J_DAC_Iout, sheet Repeat(AOUT,1,1)/Iout
NetL2_2: L2.2 R14.1 U7.6(+VO)
NetL3_2: L3.2 R31.2 U7.8(-VO)
NetLED19_2: LED19.2(A) R29.1
NetLED20_1: LED20.1(K) R30.1
NetU2_95: U8.3(VIB) ; port MCU_DAC_LATCH
NetU2_96: U8.2(VIA) ; port MCU_DAC_CLEAR
NetU2_97: U8.7(VOF) ; port MCU_DAC_FAULT

Not connected (* = marked no-connect by the designer): U7 3(CTL) 5(NC)

### Library data of the parts
C26 = 有极电容: Value: 100UF
C27 C31 C32 = 无极电容: Value: 104, 16V; Type: 贴片电容
C29 C30 = 有极电容: Value: 100UF
L1-L3 = Inductor Iron: Magnetic-Core Inductor; Published: 24-Mar-1999; LatestRevisionDate: 17-Jul-2002; LatestRevisionNote: Re-released for DXP Platform.; PackageReference: AXIAL-0.9; Publisher: Altium Limited; PackageDescription: Axial Device, Thru-Hole; 2 Leads; 0.9 in Pin Spacing
LED19 LED20 = LED0603: Typical INFRARED GaAs LED
R14 R29-R31 = 电阻: Value: 3.3K, 10%; Type: 贴片电阻
U7 = WRA2415S-3WR2: 3W，宽电压输入，隔离稳压正负双路/单路输出 DC/DC 模块电源
U8 = π162M31: Robust EMC, Low Power, 4 Out Channel, 2 Input Channel Digital Isolators.; ComponentLink1Description: Datasheet Link; ComponentLink1URL: http://www.ti.com/lit/ds/symlink/iso7340c.pdf

## Sheet subDACOut.SchDoc
size A4
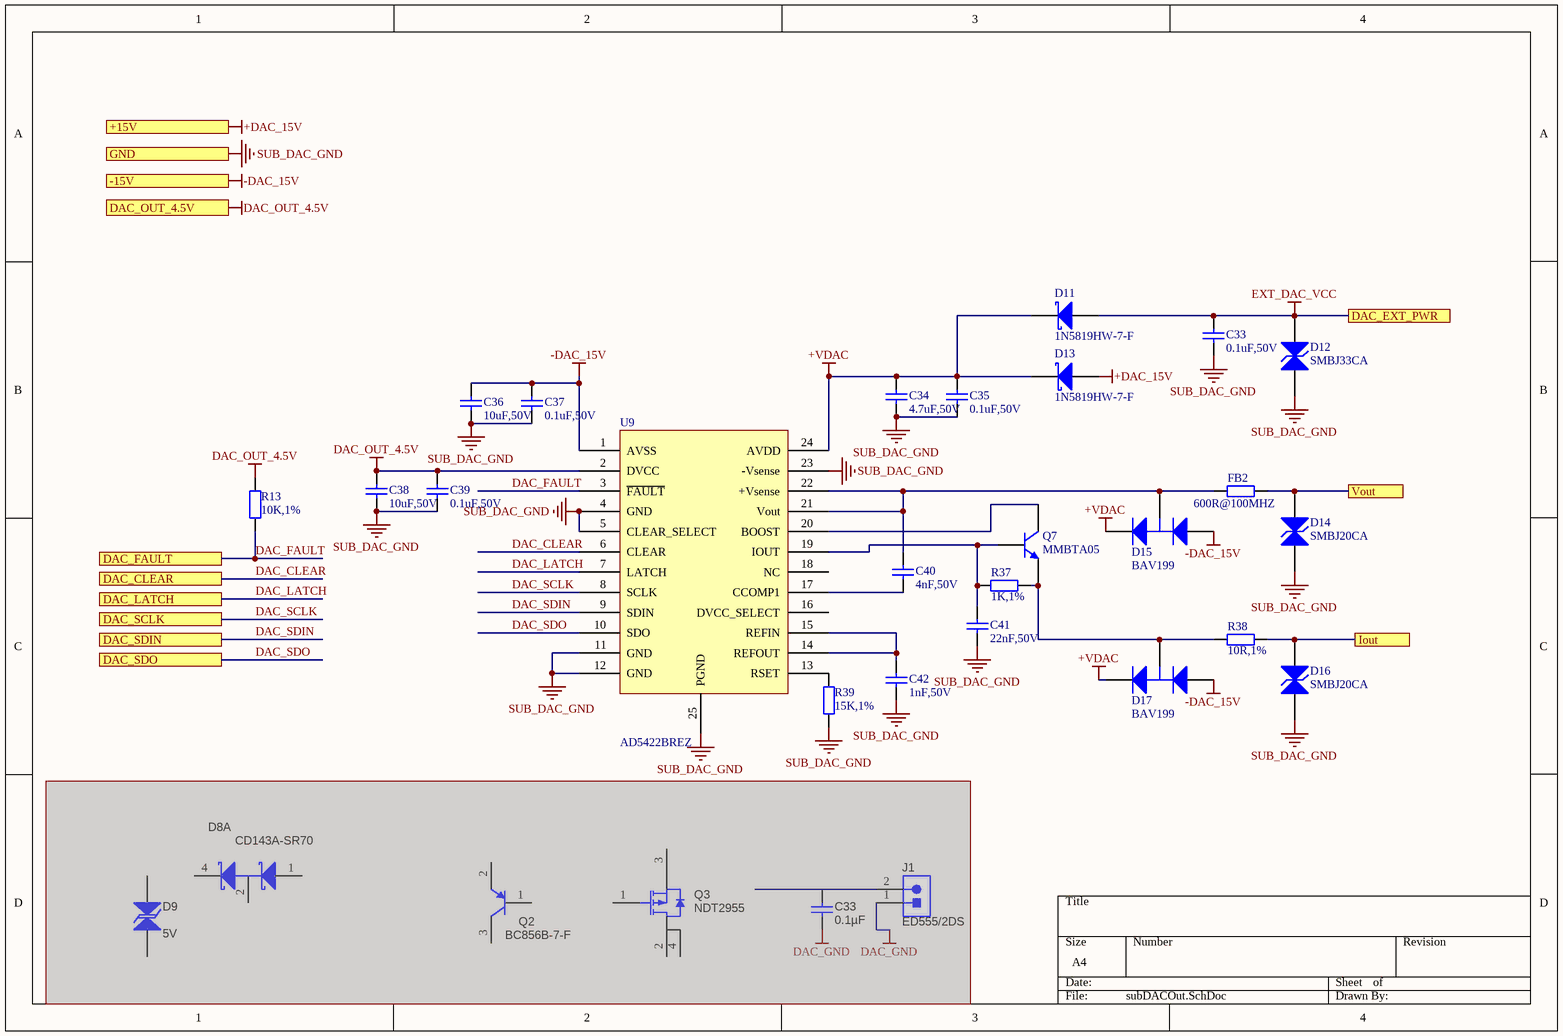
[diagram p4: subDACOut.SchDoc]

### Parts
(Parts that share a designator on the sheet are numbered #1, #2 ... from top to bottom, then left to right.)
C33#1  0.1uF,50V  [C0603]
C33#2  ValueDisplayed: 0.1µF  [0603]  (hidden comment: GRM188R71H104KA93D)  (masked out: inside a compile mask, not in the netlist)
C34  4.7uF,50V  [C0805]
C35  0.1uF,50V  [C0603]
C36  10uF,50V  [C0805]
C37  0.1uF,50V  [C0603]
C38  10uF,50V  [C0805]
C39  0.1uF,50V  [C0603]
C40  4nF,50V  [C0603]
C41  22nF,50V  [C0603]
C42  1nF,50V  [C0603]
D8#2  CD143A-SR70  [SOT-143-4]  (part A of 2)  (masked out: inside a compile mask, not in the netlist)
D9#2  value 5V  [SOD-323-Bi]  (hidden comment: CDSOD323-T05)  (masked out: inside a compile mask, not in the netlist)
D11  1N5819HW-7-F  [SOD-123_L2.8-W1.8-LS3.7-FD]
D12  SMBJ33CA  [SMB_L4.6-W3.6-LS5.3-BI]
D13  1N5819HW-7-F  [SOD-123_L2.8-W1.8-LS3.7-FD]
D14  SMBJ20CA  [SMB_L4.6-W3.6-LS5.3-BI]
D15  BAV199  [SOT-23]
D16  SMBJ20CA  [SMB_L4.6-W3.6-LS5.3-BI]
D17  BAV199  [SOT-23]
FB2  600R@100MHZ  [L0805]
J1#2  ED555/2DS  [TERM_BLK_ED555-2DS]  (masked out: inside a compile mask, not in the netlist)
Q2  BC856B-7-F  [SOT-23]  (masked out: inside a compile mask, not in the netlist)
Q3  NDT2955  [SOT-223]  (masked out: inside a compile mask, not in the netlist)
Q7  MMBTA05  [SOT-23_NPN]
R13  10K,1%  [R0603]
R37  1K,1%  [R0603]
R38  10R,1%  [R0805]
R39  15K,1%  [R0603]
U9  AD5422BREZ  [TSSOP-24_L7.8-W4.4-P0.65-LS6.4-BL-EP]

### Ports
+15V, -15V, DAC_CLEAR, DAC_EXT_PWR, DAC_FAULT, DAC_LATCH, DAC_OUT_4.5V, DAC_SCLK, DAC_SDIN, DAC_SDO, GND, Iout, Vout

### Nets
+DAC_15V: D13.1(A) ; port +15V
+VDAC: C34.1 C35.1 D11.2(K) D13.2(K) D15.2(K) D17.2(K) U9.24(AVDD)
-DAC_15V: C36.1 C37.1 D15.1(A) D17.1(A) U9.1(AVSS) ; port -15V
DAC_OUT_4.5V: C38.1 C39.1 R13.1 U9.2(DVCC) ; port DAC_OUT_4.5V  [project net DAC_4.5V]
EXT_DAC_VCC: C33#1.1 D11.1(A) D12.2(A) ; port DAC_EXT_PWR
SUB_DAC_GND: C33#1.2 C34.2 C35.2 C36.2 C37.2 C38.2 C39.2 C41.2 C42.2 D12.1(A) D14.1(A) D16.1(A) R39.2 U9.4(GND) U9.5(CLEAR_SELECT) U9.11(GND) U9.12(GND) U9.23(-Vsense) U9.25(PGND) ; port GND  [project net ISO_DAC_GND]
DAC_CLEAR: U9.6(CLEAR) ; port DAC_CLEAR
DAC_FAULT: R13.2 U9.3(~{FAULT}) ; port DAC_FAULT
DAC_LATCH: U9.7(LATCH) ; port DAC_LATCH
DAC_SCLK: U9.8(SCLK) ; port DAC_SCLK
DAC_SDIN: U9.9(SDIN) ; port DAC_SDIN
DAC_SDO: U9.10(SDO) ; port DAC_SDO
NetC40_1: C40.1 D15.3(C) FB2.1 U9.21(Vout) U9.22(+Vsense)
NetC40_2: C40.2 U9.17(CCOMP1)
NetC41_1: C41.1 Q7.B R37.1 U9.19(IOUT)
NetC42_1: C42.1 U9.14(REFOUT) U9.15(REFIN)
NetD14_2: D14.2(A) FB2.2 ; port Vout
NetD16_2: D16.2(A) R38.2 ; port Iout
NetD17_3: D17.3(C) Q7.E R37.2 R38.1
NetQ7_C: Q7.C U9.20(BOOST)
NetR39_1: R39.1 U9.13(RSET)

Not connected (* = marked no-connect by the designer): U9 16(DVCC_SELECT) 18(NC)

### Library data of the parts
C33#1 C34-C42 = CAP: Capacitor; Fitted: True
C33#2 = GRM188R71H104KA93D: CAP, CERM, 0.1uF, 50V, +/-10%, X7R, 0603; Manufacturer: MuRata; Polarized: N; CompType: Capacitor; U/M: EA; Cap_F: 0.0000001; Tolerance_%: 10; VDC_V: 50; TaMin_C: -55; TaMax_C: 125; SymbolVersion: 2008-07-09; Value: 0.1uF; PartNumber: GRM188R71H104KA93D; PackageReference: 0603; RoHS: Y; Value1: ?; Value2: 50V; MountType: SMT; Technology: Ceramic; TempCo: X7R; Cap_Case: 0603; Published: 2008-06-19; Publisher: Texas Instruments; LatestRevisionDate: 2012-04-11; LatestRevisionNote: Changed publisher; ComponentLink1Description: Datasheet link; ComponentLink1URL: http://search.murata.co.jp/Ceramy/PnsearchViewAction.do?HnOFG=ON&HnNFG=ON&SEL_CNT=50&sLang=en&sKey=GRM188R71H104KA93D&x=9&y=9&search=startwith; Alternate PartNumber: -; Alternate Manufacturer: -; Supplier 1: Digi-Key; Supplier Part Number 1: 490-1519-1-ND; Supplier 2: Farnell; Supplier Part Number 2: 1118182; Supplier 3: Arrow; Supplier Part Number 3: GRM188R71H104KA93D
D8#2 = CD143A-SR70: IC TVS ARRAY 2-LINE 70V SOT-143; Manufacturer: Bourns; SymbolVersion: use current date i.e. 2008-05-20; SymbolCreator: Use LDAP id; U/M: EA, IN, or GM; MountType: SMT; RoHS: y; PartNumber: CD143A-SR70; PackageReference: TO-253-4; ComponentLink1Description: Datasheet Link; ComponentLink1URL: http://www.digikey.com/product-detail/en/CD143A-SR70/CD143A-SR70CT-ND/1630599; CompType: TVS; Alternate PartNumber: -; Alternate Manufacturer: -; Supplier Part Number 1: CD143A-SR70CT-ND
D9#2 = CDSOD323-T05C: TVS DIODE 5VWM 9.8VC SOD323; Manufacturer: Bourns; U/M: EA; Power_W: 350; Vr_V: 5; Value1: 350W; AEC Category: Q101; CompType: TVS; SymbolVersion: 2012-01-13; PartNumber: CDSOD323-T05; PackageReference: SOD323, 2-Leads, Body 1.9x1.45mm, No Polarity Mark; Vz_V: N/A; MountType: SMT; RoHS: Y; ComponentLink1Description: Datasheet link; ComponentLink1URL: http://www.bourns.com/data/global/pdfs/CDSOD323-TxxC.PDF; Published: 2008-10-08; Publisher: Texas Instruments; LatestRevisionDate: 2015-10-06; LatestRevisionNote: Updated Supplier Data; Supplier 1: Digi-Key; Supplier Part Number 1: CDSOD323-T05CT-ND; AEC Qualified: ?
D11 D13 = D Schottky: Schottky Diode; Published: 8-Jun-2000; LatestRevisionDate: 17-Jul-2002; LatestRevisionNote: Re-released for DXP Platform.; PackageReference: SMB; Publisher: Altium Limited; PackageDescription: DO-214-AA/SMB; 2 C-Bend Leads; Body 5.3 x 3.6 mm, inc. leads (LxW); Code_JEDEC: DO-214-AA
D12 D14 D16 = SMBJ12CA: Transient Voltage  Suppressors (TVS)
D15 D17 = BAV199: as D4 on sheet subADCIn; Published: 8-Jun-2000; DatasheetDocument: Oct-1999; PackageDocument: Sep-2001; PackageReference: SOT-23; Publisher: Altium Limited; ComponentLink1Description: Manufacturer Link; ComponentLink1URL: http://www.infineon.com/; ComponentLink2Description: Datasheet; ComponentLink2URL: http://www.infineon.com/upload/Document/cmc_upload/documents/009/441/bav199series_1.pdf
FB2 = 电阻: Value: 3.3K, 10%; Type: 贴片电阻
J1#2 = ED555/2DS: Terminal Block, 6A, 3.5mm Pitch, 2-Pos, TH; Manufacturer: On-Shore Technology; SymbolCreator: a0412235; CompType: Connector; U/M: EA; SymbolVersion: 2013-10-31; PartNumber: ED555/2DS; PackageReference: 7.0x8.2x6.5mm; RoHS: Y; MountType: TH; ComponentLink1Description: Datasheet Link; ComponentLink1URL: http://on-shore.com/sites/default/files/manuals/ed555ds.pdf; Publisher: Texas Instruments; LatestRevisionDate: 2015-10-01; Supplier 1: Digi-Key; Supplier Part Number 1: ED1514-ND
Q2 = BC856B-7-F, Diodes Inc.: Transistor, PNP, 65 V, 0.1 A, SOT-23; CompType: BJT; PNP: 1; NPN: 0; Vceo_V: 65; Vcesat1_V: 0.075; Value: 65 V; IcRated_A: 0.1; Value1: 0.1 A; HfeMax: 330; TaMin_C: -65; TaMax_C: 150; U/M: EA; AEC Category: Q101; SymbolVersion: 2008-07-31; PartNumber: BC856B-7-F; Manufacturer: Diodes Inc.; PackageReference: SOT-23; RoHS: Y; Value2: 330; Published: 2008-07-31; LatestRevisionDate: 2015-09-25; Publisher: Texas Instruments; ComponentLink1Description: Datasheet link; ComponentLink1URL: http://www.diodes.com/datasheets/ds11207.pdf; Supplier 1: Digi-Key; Supplier Part Number 1: BC856B-7FDICT-ND; Supplier 2: Farnell; Supplier Part Number 2: 1773623; MountType: SMT; AEC Qualified: ?
Q3 = NDT2955: MOSFET, P-CH, -60 V, -2.5 A, SOT-223; Manufacturer: Fairchild Semiconductor; Alternate Manufacturer: None; SymbolCreator: a0799628; U/M: EA; ChType: P; Value: -60V; Value1: 0.5 ohm; Rdson45_ohm: 0.5; Value2: 11 nC; QgTyp_nC: 11; Vgs_V: 20; AEC Category: Q101; SymbolVersion: 2013-04-29; PartNumber: NDT2955; PackageReference: SOT-223; CompType: MOSFET; VdsMax_V: -60; IdsMax_A: -2.5; RoHS: Y; MountType: SMT; Published: 2008-06-19; Publisher: Texas Instruments; LatestRevisionDate: 2015-10-01; LatestRevisionNote: Added parts.; ComponentLink1Description: Datasheet link; ComponentLink1URL: http://www.fairchildsemi.com/ds/ND/NDT2955.pdf; Supplier 1: Digi-Key; Supplier Part Number 1: NDT2955CT-ND; Supplier 2: Mouser; Supplier Part Number 2: 512-NDT2955; Supplier 3: Farnell; Supplier Part Number 3: 2323215; AEC Qualified: ?
Q7 = S8050: NPN General Purpose Amplifier; Published: 8-Jun-2000; LatestRevisionDate: 15-Jan-2003; LatestRevisionNote: PCB Footprint 'BCY-W3/D4.7' replaced; DatasheetVersion: 1997; PackageVersion: Sep-1998; PackageReference: TO-92A; Publisher: Altium Limited; PackageDescription: TO, Flat Index; 3 In-Line, Axial Leads; Body Dia. 4.5mm; Leads 0.51 x 0.48 mm (max); ComponentLink1Description: Manufacturer Link; ComponentLink1URL: http://www.fairchildsemi.com/; ComponentLink2Description: Datasheet; ComponentLink2URL: http://www.fairchildsemi.com/ds/2N%2F2N3904.pdf
R13 R37-R39 = 电阻: Value: 3.3K, 10%; Type: 贴片电阻
U9 = AD5422BREZ: 单通道、12/16位、串行输入、内置电流源 / 和电压输出DAC，具有HART连接能力

## Sheet dIn.SchDoc
size A4
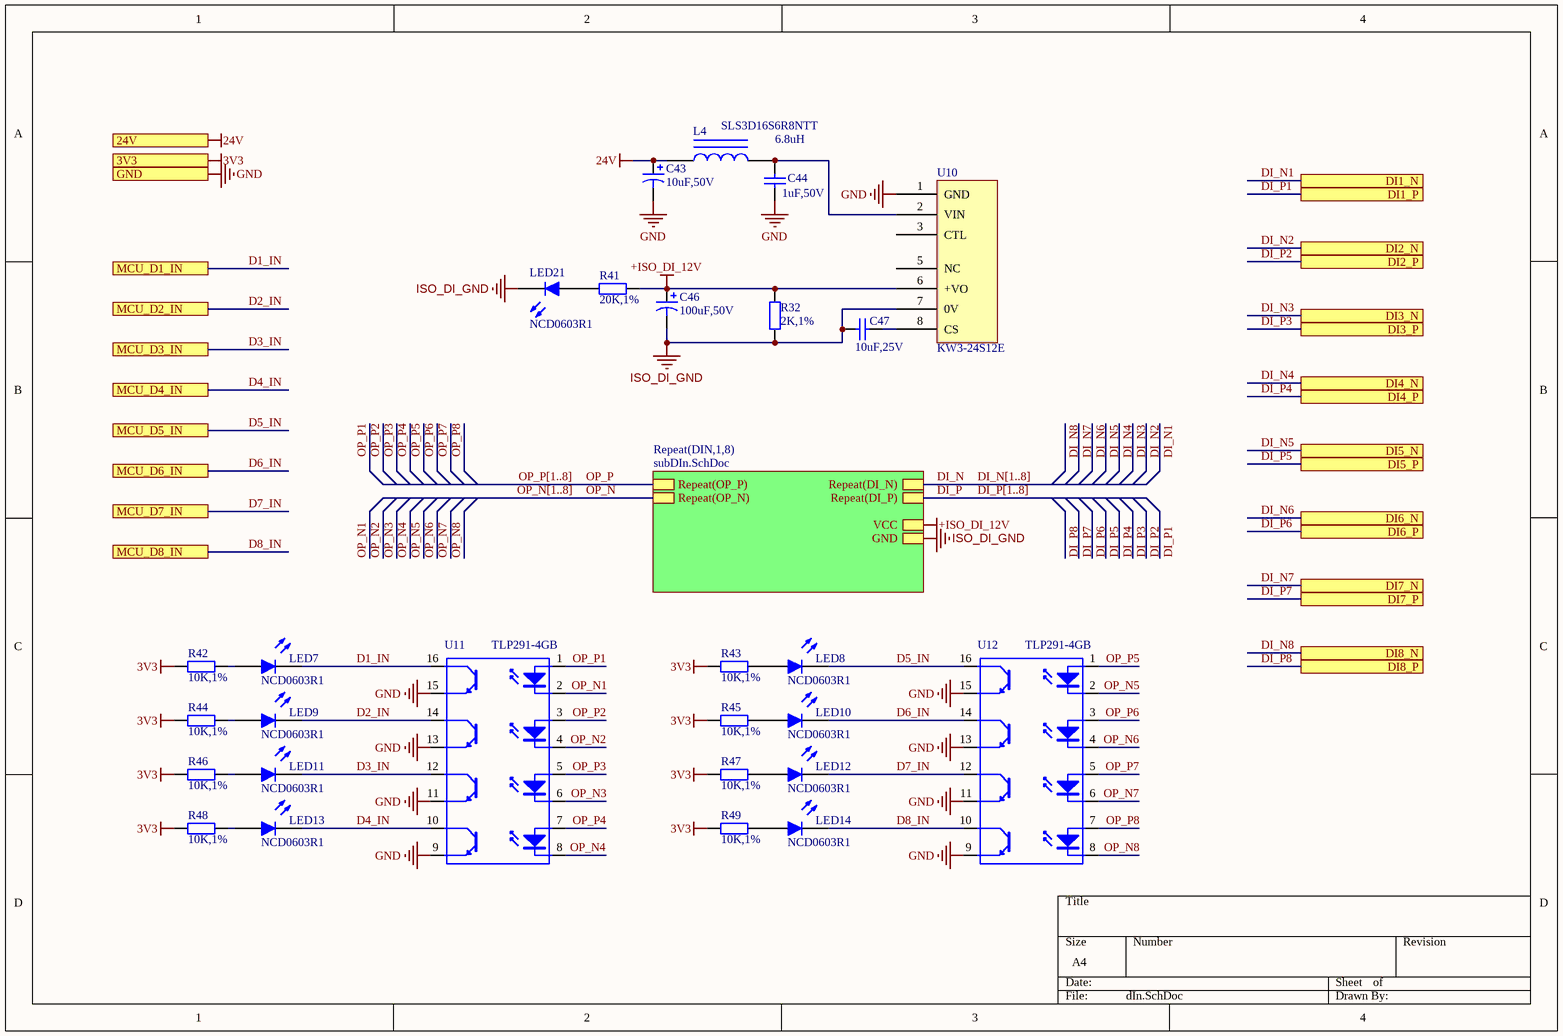
[diagram p5: dIn.SchDoc]

### Parts
C43  10uF,50V  [CAP-TH_BD5.0-P2.00-D0.8-FD]
C44  1uF,50V  [C0603]
C46  100uF,50V  [CAP-TH_BD6.3-P2.50-D1.0-FD]
C47  10uF,25V  [C0805]
L4  SLS3D16S6R8NTT  value 6.8uH  [IND-SMD_L4.0-W4.0_SLS3DXX]
LED7  NCD0603R1  [LED0603-RD]
LED8  NCD0603R1  [LED0603-RD]
LED9  NCD0603R1  [LED0603-RD]
LED10  NCD0603R1  [LED0603-RD]
LED11  NCD0603R1  [LED0603-RD]
LED12  NCD0603R1  [LED0603-RD]
LED13  NCD0603R1  [LED0603-RD]
LED14  NCD0603R1  [LED0603-RD]
LED21  NCD0603R1  [LED0603-RD]
R32  2K,1%  [R0603]
R41  20K,1%  [R0603]
R42  10K,1%  [R0603]
R43  10K,1%  [R0603]
R44  10K,1%  [R0603]
R45  10K,1%  [R0603]
R46  10K,1%  [R0603]
R47  10K,1%  [R0603]
R48  10K,1%  [R0603]
R49  10K,1%  [R0603]
U10  KW3-24S12E  [PWRM-TH_WRA2415S-3WR2]
U11  TLP291-4GB  [SOP-16_L10.3-W4.4-P1.27-LS7.0-BL]
U12  TLP291-4GB  [SOP-16_L10.3-W4.4-P1.27-LS7.0-BL]

### Sub-sheets
Repeat(DIN,1,8) = subDIn.SchDoc: GND, VCC, Repeat(DI_P), Repeat(DI_N), Repeat(OP_P), Repeat(OP_N)

### Ports
3V3, 24V, DI1_N, DI1_P, DI2_N, DI2_P, DI3_N, DI3_P, DI4_N, DI4_P, DI5_N, DI5_P, DI6_N, DI6_P, DI7_N, DI7_P, DI8_N, DI8_P, GND, MCU_D1_IN, MCU_D2_IN, MCU_D3_IN, MCU_D4_IN, MCU_D5_IN, MCU_D6_IN, MCU_D7_IN, MCU_D8_IN

### Nets
3V3: R42.2 R43.2 R44.2 R45.2 R46.2 R47.2 R48.2 R49.2 ; port 3V3
24V: C43.1 L4.1 ; port 24V
+ISO_DI_12V: C46.1 R32.2 R41.2 U10.6(+VO) ; sheet Repeat(DIN,1,8)/VCC
GND: C43.2 C44.1 U10.1(GND) U11.9(E) U11.11(E) U11.13(E) U11.15(E) U12.9(E) U12.11(E) U12.13(E) U12.15(E) ; port GND
ISO_DI_GND: C46.2 C47.1 LED21.1(K) R32.1 U10.7(0V) ; sheet Repeat(DIN,1,8)/GND
D1_IN: LED7.1(K) U11.16(C) ; port MCU_D1_IN
D2_IN: LED9.1(K) U11.14(C) ; port MCU_D2_IN
D3_IN: LED11.1(K) U11.12(C) ; port MCU_D3_IN
D4_IN: LED13.1(K) U11.10(C) ; port MCU_D4_IN
D5_IN: LED8.1(K) U12.16(C) ; port MCU_D5_IN
D6_IN: LED10.1(K) U12.14(C) ; port MCU_D6_IN
D7_IN: LED12.1(K) U12.12(C) ; port MCU_D7_IN
D8_IN: LED14.1(K) U12.10(C) ; port MCU_D8_IN
DI_N: sheet Repeat(DIN,1,8)/Repeat(DI_N)
DI_N1: U11.2(K) ; port DI1_N  [also labelled OP_N1]
DI_N2: U11.4(K) ; port DI2_N  [also labelled OP_N2]
DI_N3: U11.6(K) ; port DI3_N  [also labelled OP_N3]
DI_N4: U11.8(K) ; port DI4_N  [also labelled OP_N4]
DI_N5: U12.2(K) ; port DI5_N  [also labelled OP_N5]
DI_N6: U12.4(K) ; port DI6_N  [also labelled OP_N6]
DI_N7: U12.6(K) ; port DI7_N  [also labelled OP_N7]
DI_N8: U12.8(K) ; port DI8_N  [also labelled OP_N8]
DI_P: sheet Repeat(DIN,1,8)/Repeat(DI_P)
OP_N: sheet Repeat(DIN,1,8)/Repeat(OP_N)
OP_P: sheet Repeat(DIN,1,8)/Repeat(OP_P)
OP_P1: U11.1
OP_P2: U11.3(A)
OP_P3: U11.5(A)
OP_P4: U11.7(A)
OP_P5: U12.1
OP_P6: U12.3(A)
OP_P7: U12.5(A)
OP_P8: U12.7(A)
NetC44_2: C44.2 L4.2 U10.2(VIN)
NetC47_2: C47.2 U10.8(CS)
NetLED7_2: LED7.2(A) R42.1
NetLED8_2: LED8.2(A) R43.1
NetLED9_2: LED9.2(A) R44.1
NetLED10_2: LED10.2(A) R45.1
NetLED11_2: LED11.2(A) R46.1
NetLED12_2: LED12.2(A) R47.1
NetLED13_2: LED13.2(A) R48.1
NetLED14_2: LED14.2(A) R49.1
NetLED21_2: LED21.2(A) R41.1

Not connected (* = marked no-connect by the designer): U10 3(CTL) 5(NC)

### Buses and harness runs
bus DI_N[1..8]
bus DI_P[1..8]
bus OP_N[1..8]
bus OP_P[1..8]

### Library data of the parts
C43 = 有极电容: Value: 100UF
C44 C47 = 无极电容: Value: 104, 16V; Type: 贴片电容
C46 = 有极电容: Value: 100UF
L4 = Inductor Iron: Magnetic-Core Inductor; Published: 24-Mar-1999; LatestRevisionDate: 17-Jul-2002; LatestRevisionNote: Re-released for DXP Platform.; PackageReference: AXIAL-0.9; Publisher: Altium Limited; PackageDescription: Axial Device, Thru-Hole; 2 Leads; 0.9 in Pin Spacing
LED7-LED14 LED21 = LED0603: Typical INFRARED GaAs LED
R32 R41 = 电阻: Value: 3.3K, 10%; Type: 贴片电阻
R42-R49 = 电阻: Value: 5.1K, 1%; Type: 贴片电阻
U10 = KW3-24S12E: 3W，宽电压输入，隔离稳压输出 DC/DC 模块电源
U11 U12 = TLP624-4: name: 4路光耦

## Sheet subDIn.SchDoc
size A4
Used 8 times, as channels U_dIn/DIN1, U_dIn/DIN2, U_dIn/DIN3, U_dIn/DIN4, U_dIn/DIN5, U_dIn/DIN6, U_dIn/DIN7, U_dIn/DIN8. Parts and nets are listed once, with the designators drawn on the sheet.
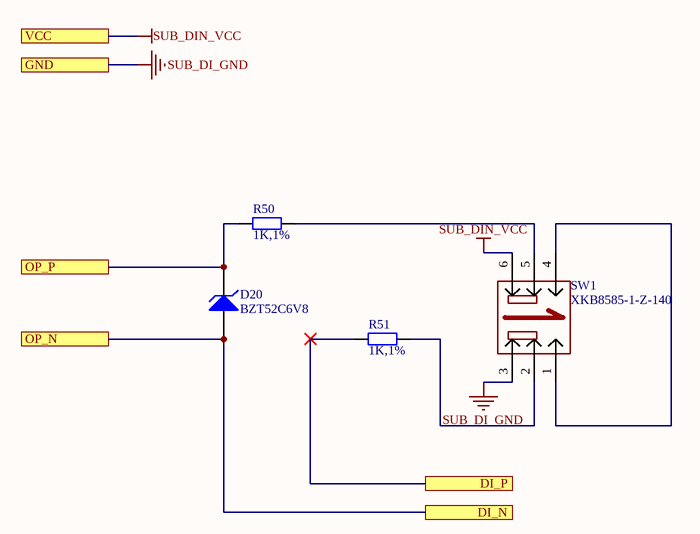
[diagram p6: subDIn.SchDoc]

### Parts
D20  BZT52C6V8  [SOD-123]
R50  1K,1%  [R0603]
R51  1K,1%  [R0603]
SW1  XKB8585-1-Z-140  [SW-TH_6P-L8.6-W8.6-P2.50-LS5.4]

### Ports
DI_N, DI_P, GND, OP_N, OP_P, VCC

### Nets
SUB_DI_GND: SW1.3 ; port GND
SUB_DIN_VCC: SW1.6 ; port VCC
DI_N: D20.1(A) ; port OP_N, port DI_N
DI_P: R51.2 ; port DI_P
OP_P: D20.2(K) R50.2 ; port OP_P
NetR50_1: R50.1 SW1.5
NetR51_1: R51.1 SW1.2
NetSW1_1: SW1.1 SW1.4

### Channels
U_dIn/DIN1: designators end in _DIN1; ports DI_N=DI_N1 DI_P=DI_P1 GND=ISO_DI_GND OP_N=DI_N1 OP_P=OP_P1 VCC=+ISO_DI_12V
U_dIn/DIN2: designators end in _DIN2; ports DI_N=DI_N2 DI_P=DI_P2 GND=ISO_DI_GND OP_N=DI_N2 OP_P=OP_P2 VCC=+ISO_DI_12V
U_dIn/DIN3: designators end in _DIN3; ports DI_N=DI_N3 DI_P=DI_P3 GND=ISO_DI_GND OP_N=DI_N3 OP_P=OP_P3 VCC=+ISO_DI_12V
U_dIn/DIN4: designators end in _DIN4; ports DI_N=DI_N4 DI_P=DI_P4 GND=ISO_DI_GND OP_N=DI_N4 OP_P=OP_P4 VCC=+ISO_DI_12V
U_dIn/DIN5: designators end in _DIN5; ports DI_N=DI_N5 DI_P=DI_P5 GND=ISO_DI_GND OP_N=DI_N5 OP_P=OP_P5 VCC=+ISO_DI_12V
U_dIn/DIN6: designators end in _DIN6; ports DI_N=DI_N6 DI_P=DI_P6 GND=ISO_DI_GND OP_N=DI_N6 OP_P=OP_P6 VCC=+ISO_DI_12V
U_dIn/DIN7: designators end in _DIN7; ports DI_N=DI_N7 DI_P=DI_P7 GND=ISO_DI_GND OP_N=DI_N7 OP_P=OP_P7 VCC=+ISO_DI_12V
U_dIn/DIN8: designators end in _DIN8; ports DI_N=DI_N8 DI_P=DI_P8 GND=ISO_DI_GND OP_N=DI_N8 OP_P=OP_P8 VCC=+ISO_DI_12V

### Library data of the parts
D20 = BZT52C6V8: Surface Mount Zener Diode; Published: 8-Jun-2000; LatestRevisionDate: 17-Jul-2002; LatestRevisionNote: Re-released for DXP Platform.; DatasheetDocument: REV. L-2; PackageReference: SOD-123; Publisher: Altium Limited; ComponentLink1Description: Manufacturer Link; ComponentLink1URL: http://www.vishay.com/
R50 R51 = 电阻: Value: 5.1K, 1%; Type: 贴片电阻
SW1 = XKB8585-1-Z-140: 按键开关 六脚 外扣 有声自锁

## Sheet dOut.SchDoc
size A4

## Sheet link.SchDoc
size A4
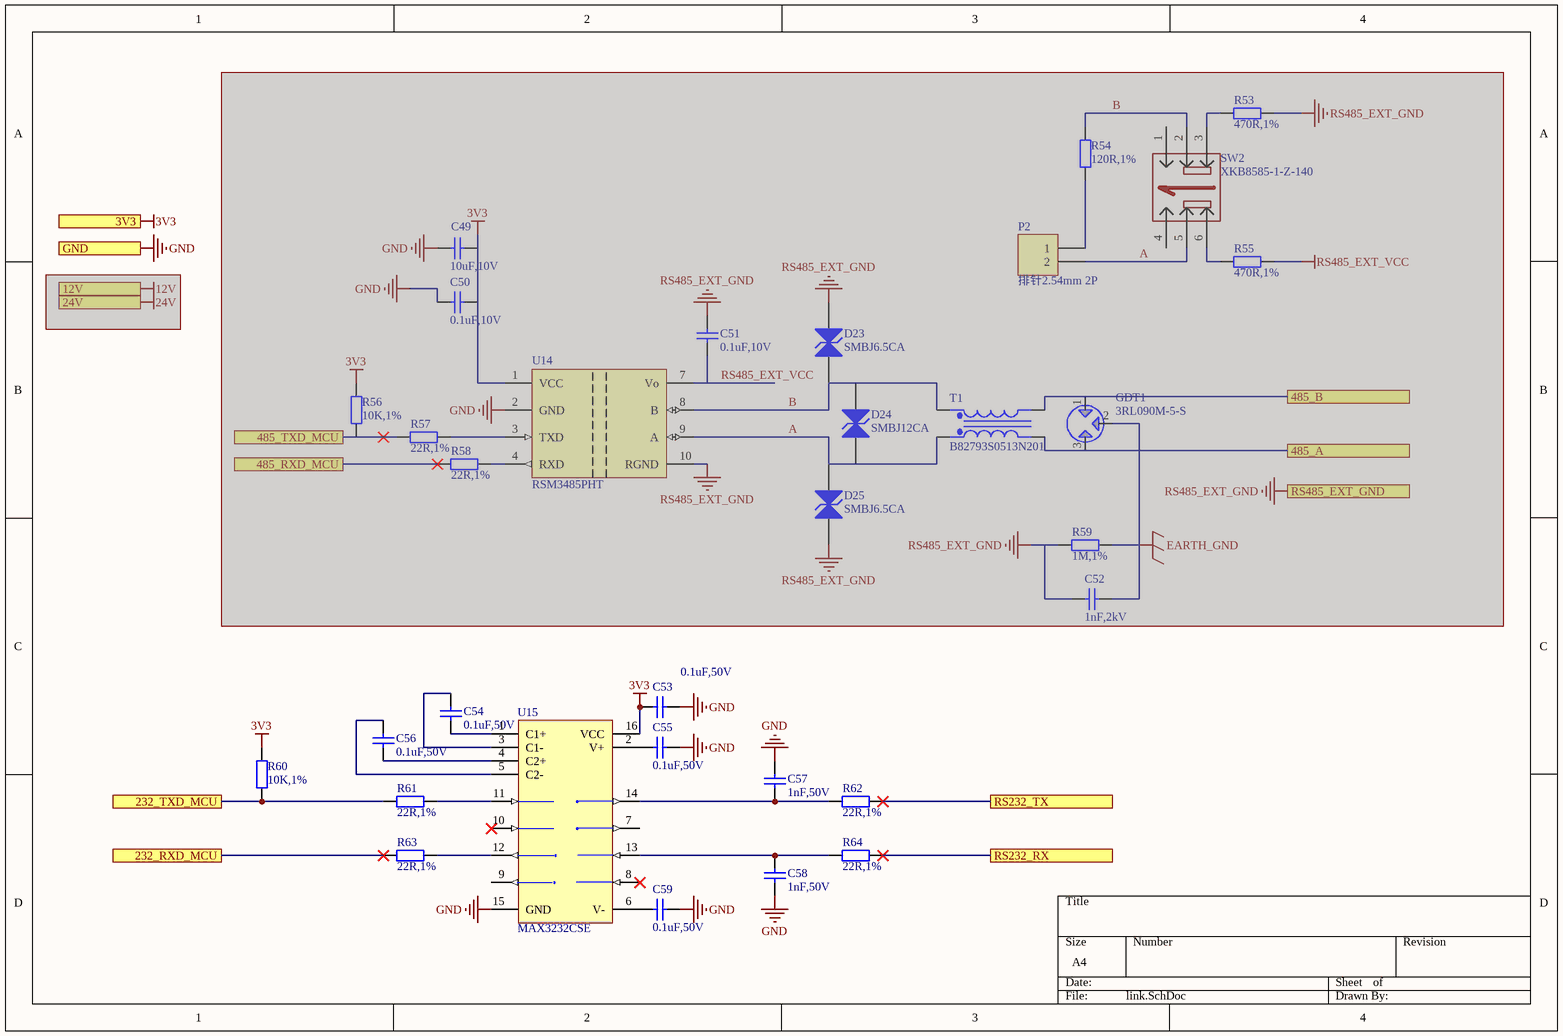
[diagram p7: link.SchDoc]

### Parts
(Parts that share a designator on the sheet are numbered #1, #2 ... from top to bottom, then left to right.)
C49  10uF,10V  [C0603]  (masked out: inside a compile mask, not in the netlist)
C50  0.1uF,10V  [C0603]  (masked out: inside a compile mask, not in the netlist)
C51  0.1uF,10V  [C0603]  (masked out: inside a compile mask, not in the netlist)
C52  1nF,2kV  [C1206]  (masked out: inside a compile mask, not in the netlist)
C53  0.1uF,50V  [C0603]
C54  0.1uF,50V  [C0603]
C55  0.1uF,50V  [C0603]
C56  0.1uF,50V  [C0603]
C57  1nF,50V  [C0603]
C58  1nF,50V  [C0603]
C59  0.1uF,50V  [C0603]
D23  SMBJ6.5CA  [SMB_L4.6-W3.6-LS5.3-BI]  (masked out: inside a compile mask, not in the netlist)
D24  SMBJ12CA  [SMB_L4.6-W3.6-LS5.3-BI]  (masked out: inside a compile mask, not in the netlist)
D25  SMBJ6.5CA  [SMB_L4.6-W3.6-LS5.3-BI]  (masked out: inside a compile mask, not in the netlist)
GDT1  3RL090M-5-S  [DIO-DT-SMD_L7.2-W5.0]  (masked out: inside a compile mask, not in the netlist)
P2#2  排针2.54mm 2P  [HDR1X2]  (masked out: inside a compile mask, not in the netlist)
R53  470R,1%  [R0603]  (masked out: inside a compile mask, not in the netlist)
R54  120R,1%  [R0603]  (masked out: inside a compile mask, not in the netlist)
R55  470R,1%  [R0603]  (masked out: inside a compile mask, not in the netlist)
R56  10K,1%  [R0603]  (masked out: inside a compile mask, not in the netlist)
R57  22R,1%  [R0603]  (masked out: inside a compile mask, not in the netlist)
R58  22R,1%  [R0603]  (masked out: inside a compile mask, not in the netlist)
R59  1M,1%  [R1206]  (masked out: inside a compile mask, not in the netlist)
R60  10K,1%  [R0603]
R61  22R,1%  [R0603]
R62  22R,1%  [R0603]
R63  22R,1%  [R0603]
R64  22R,1%  [R0603]
SW2  XKB8585-1-Z-140  [SW-TH_6P-L8.6-W8.6-P2.50-LS5.4]  (masked out: inside a compile mask, not in the netlist)
T1  B82793S0513N201  [FILTER-SMD_4P-L9.0-W6.0_B82790]  (masked out: inside a compile mask, not in the netlist)
U14  RSM3485PHT  [COMM-TH_RSM3485PHT]  (masked out: inside a compile mask, not in the netlist)
U15  MAX3232CSE  [NSO16_N]

### Ports
3V3, 12V, 24V, 232_RXD_MCU, 232_TXD_MCU, 485_A, 485_B, 485_RXD_MCU, 485_TXD_MCU, GND, RS232_RX, RS232_TX, RS485_EXT_GND

### Nets
3V3: C53.2 R60.2 U15.16(VCC) ; port 3V3
GND: C53.1 C55.1 C57.2 C58.2 C59.1 U15.15(GND) ; port GND
USART2_RX: R63.1 ; port 232_RXD_MCU
USART2_TX: R60.1 R61.1 ; port 232_TXD_MCU
NetC54_1: C54.1 U15.1(C1+)
NetC54_2: C54.2 U15.3(C1-)
NetC55_2: C55.2 U15.2(V+)
NetC56_1: C56.1 U15.4(C2+)
NetC56_2: C56.2 U15.5(C2-)
NetC57_1: C57.1 R62.1 U15.14(T1OUT)
NetC58_1: C58.1 R64.1 U15.13(R1IN)
NetC59_2: C59.2 U15.6(V-)
NetJ1#1_2: R62.2 ; port RS232_TX
NetJ1#1_3: R64.2 ; port RS232_RX
NetR61_2: R61.2 U15.11(T1IN)
NetR63_2: R63.2 U15.12(R1OUT)

Not connected (* = marked no-connect by the designer): U15 7(T2OUT) 8(R2IN)* 9(R2OUT) 10(T2IN)*

### Library data of the parts
C49-C59 = 无极电容: Value: 104, 16V; Type: 贴片电容
D23-D25 = SMBJ12CA: Transient Voltage  Suppressors (TVS)
GDT1 = 3RL090M-5-S: Gas Discharge Tube
P2#2 = Header 2: Header, 2-Pin; LatestRevisionDate: 17-Jul-2002; LatestRevisionNote: Re-released for DXP Platform.; Publisher: Altium Limited
R53-R64 = 电阻: Value: 3.3K, 10%; Type: 贴片电阻
SW2 = XKB8585-1-Z-140: 按键开关 六脚 外扣 有声自锁
T1 = B82793S0513N201: 共模电感，电感 @ 频率：51uH @ 100kHz ，直流电阻（DCR）（最大） 140mΩ
U14 = RSM3485PHT: 隔离485
U15 = MAX3232CSE: 3.0V TO 5.5V, Low-Power, up to 1Mbps, True RS-232 Transceiver Using Four 0.1礔 External Capacitor; Published: 16-Jan-2001; LatestRevisionDate: 13-Apr-2006; LatestRevisionNote: IPC-7351 Footprint Added.; DatasheetVersion: Mar-1999; PackageReference: NSO16; Publisher: Altium Limited; PackageDescription: 16-Pin Small Outline Integrated Circuit 1.27 mm Pitch; Code_JEDEC: MS-012-AC; Code_IPC: SOIC127P600-16; ComponentLink1Description: Manufacturer Link; ComponentLink1URL: http://www.maxim-ic.com/; ComponentLink2Description: Datasheet; ComponentLink2URL: http://pdfserv.maxim-ic.com/en/ds/MAX3222-MAX3241.pdf

## Sheet mcu.SchDoc
size A3
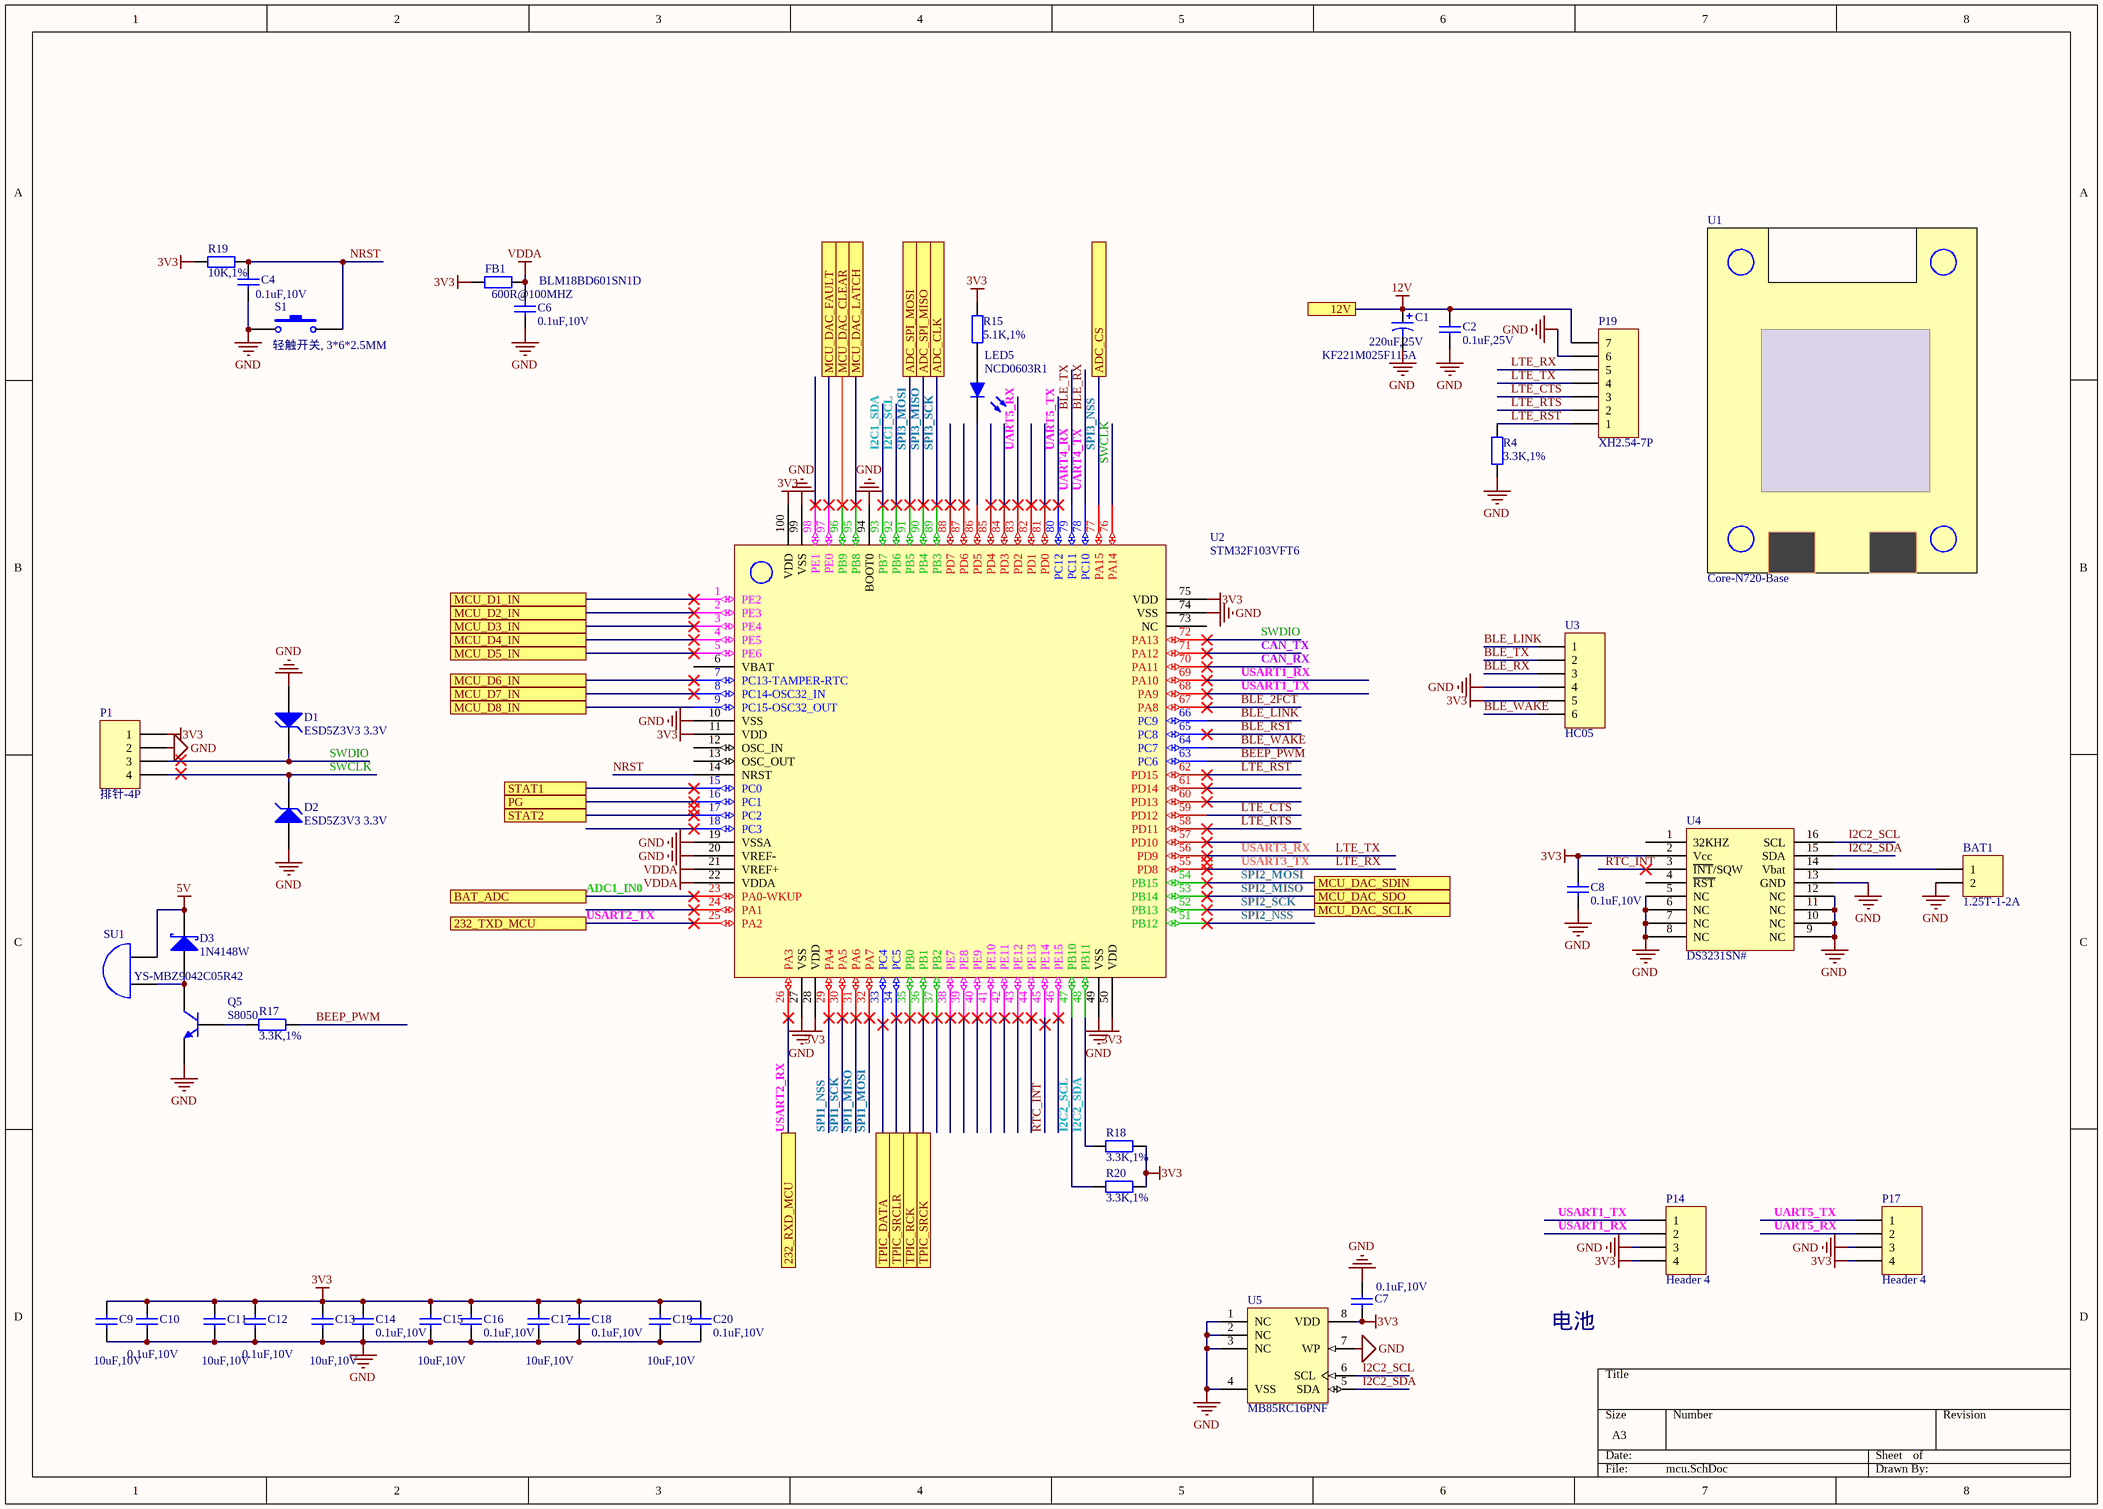
[diagram p8: mcu.SchDoc]

### Parts
(Parts that share a designator on the sheet are numbered #1, #2 ... from top to bottom, then left to right.)
BAT1  1.25T-1-2A  [1.25T-1-2A]
C1  220uF,25V  value KF221M025F115A  [CAP-TH_BD8.0-P3.50-D1.0-FD]
C2  0.1uF,25V  [C0603]
C4  0.1uF,10V  [C0603]
C6  0.1uF,10V  [C0603]
C7  0.1uF,10V  [C0603]
C8  0.1uF,10V  [C0603]
C9  10uF,10V  [C0603]
C10  0.1uF,10V  [C0603]
C11  10uF,10V  [C0603]
C12  0.1uF,10V  [C0603]
C13  10uF,10V  [C0603]
C14  0.1uF,10V  [C0603]
C15  10uF,10V  [C0603]
C16  0.1uF,10V  [C0603]
C17  10uF,10V  [C0603]
C18  0.1uF,10V  [C0603]
C19  10uF,10V  [C0603]
C20  0.1uF,10V  [C0603]
D1  ESD5Z3V3 3.3V  [SOD-523]
D2  ESD5Z3V3 3.3V  [SOD-523]
D3  1N4148W  [SOD-123_L2.8-W1.8-LS3.7-RD]
FB1  600R@100MHZ  value BLM18BD601SN1D  [L0603]
LED5  NCD0603R1  [LED0603-RD]
P1  排针-4P  [HDR1X4]
P14#2  Header 4  [HDR1X4]
P17  Header 4  [HDR1X4]
P19  XH2.54-7P  [XH2.54-7P-弯脚]
Q5  S8050  [SOT-23_NPN]
R4  3.3K,1%  [R0603]
R15  5.1K,1%  [R0603]
R17  3.3K,1%  [R0603]
R18  3.3K,1%  [R0603]
R19  10K,1%  [R0603]
R20  3.3K,1%  [R0603]
S1  轻触开关, 3*6*2.5MM  [3*6*2.5MM]
SU1  YS-MBZ9042C05R42  [BUZ-TH_BD9.0-P4.00-D1.0-FD]
U1  Core-N720-Base  [Core-N720-Base]
U2  STM32F103VFT6  [LQFP100_L]
U3  HC05  [HDR1X6]
U4  DS3231SN#  [SOIC-16_L10.3-W7.5-P1.27-LS10.3-BL]
U5  MB85RC16PNF  [8S1_N]

### Ports
12V, 232_RXD_MCU, 232_TXD_MCU, ADC_CLK, ADC_CS, ADC_SPI_MISO, ADC_SPI_MOSI, BAT_ADC, MCU_D1_IN, MCU_D2_IN, MCU_D3_IN, MCU_D4_IN, MCU_D5_IN, MCU_D6_IN, MCU_D7_IN, MCU_D8_IN, MCU_DAC_CLEAR, MCU_DAC_FAULT, MCU_DAC_LATCH, MCU_DAC_SCLK, MCU_DAC_SDIN, MCU_DAC_SDO, PG, STAT1, STAT2, TPIC_DATA, TPIC_RCK, TPIC_SRCK, TPIC_SRCLR

### Nets
3V3: C7.1 C8.2 C9.2 C10.2 C11.2 C12.2 C13.2 C14.2 C15.2 C16.2 C17.2 C18.2 C19.2 C20.2 FB1.1 P1.1 P14#2.4 P17.4 R15.2 R18.1 R19.1 R20.1 U2.11(VDD) U2.28(VDD) U2.50(VDD) U2.75(VDD) U2.100(VDD) U3.5 U4.2(Vcc) U5.8(VDD)
5V: D3.2(K) SU1.2(B)
12V: C1.1 C2.2 P19.7 ; port 12V
GND: BAT1.2 C1.2 C2.1 C4.1 C6.2 C7.2 C8.1 C9.1 C10.1 C11.1 C12.1 C13.1 C14.1 C15.1 C16.1 C17.1 C18.1 C19.1 C20.1 D1.1(A) D2.1(A) P1.2 P14#2.3 P17.3 P19.6 Q5.E R4.2 S1.1 U2.10(VSS) U2.19(VSSA) U2.20(VREF-) U2.27(VSS) U2.49(VSS) U2.74(VSS) U2.94(BOOT0) U2.99(VSS) U3.4 U4.5(NC) U4.6(NC) U4.7(NC) U4.8(NC) U4.9(NC) U4.10(NC) U4.11(NC) U4.12(NC) U4.13(GND) U5.1(NC) U5.2(NC) U5.3(NC) U5.4(VSS) U5.7(WP)
VDDA: C6.1 FB1.2 U2.21(VREF+) U2.22(VDDA)
ADC1_IN0: U2.23(PA0-WKUP) ; port BAT_ADC
BEEP_PWM: R17.2 U2.63(PC6)
BLE_2FCT: U2.67(PA8)
BLE_LINK: U2.66(PC9) U3.1
BLE_RST: U2.65(PC8)
BLE_RX: U2.78(PC10) U3.3  [also labelled UART4_TX]
BLE_TX: U2.79(PC11) U3.2  [also labelled UART4_RX]
BLE_WAKE: U2.64(PC7) U3.6
CAN_RX: U2.70(PA11)
CAN_TX: U2.71(PA12)
D1_IN: U2.1(PE2) ; port MCU_D1_IN
D2_IN: U2.2(PE3) ; port MCU_D2_IN
D3_IN: U2.3(PE4) ; port MCU_D3_IN
D4_IN: U2.4(PE5) ; port MCU_D4_IN
D5_IN: U2.5(PE6) ; port MCU_D5_IN
D6_IN: U2.7(PC13-TAMPER-RTC) ; port MCU_D6_IN
D7_IN: U2.8(PC14-OSC32_IN) ; port MCU_D7_IN
D8_IN: U2.9(PC15-OSC32_OUT) ; port MCU_D8_IN
I2C1_SCL: U2.92(PB6)
I2C1_SDA: U2.93(PB7)
I2C2_SCL: R20.2 U2.47(PB10) U4.16(SCL) U5.6(SCL)
I2C2_SDA: R18.2 U2.48(PB11) U4.15(SDA) U5.5(SDA)
LTE_CTS: P19.3 U2.59(PD12)
LTE_RST: P19.1 R4.1 U2.62(PD15)
LTE_RTS: P19.2 U2.58(PD11)
LTE_RX: P19.5 U2.55(PD8)  [also labelled USART3_TX]
LTE_TX: P19.4 U2.56(PD9)  [also labelled USART3_RX]
NRST: C4.2 R19.2 S1.2 U2.14(NRST)
PG: U2.16(PC1) ; port PG
RTC_INT: U2.45(PE14) U4.3(~{INT}/SQW)
SPI1_MISO: U2.31(PA6)
SPI1_MOSI: U2.32(PA7)
SPI1_NSS: U2.29(PA4)
SPI1_SCK: U2.30(PA5)
SPI2_MISO: U2.53(PB14) ; port MCU_DAC_SDO
SPI2_MOSI: U2.54(PB15) ; port MCU_DAC_SDIN
SPI2_NSS: U2.51(PB12)
SPI2_SCK: U2.52(PB13) ; port MCU_DAC_SCLK
SPI3_MISO: U2.90(PB4) ; port ADC_SPI_MISO  [project net ADC_SPI_MISO]
SPI3_MOSI: U2.91(PB5) ; port ADC_SPI_MOSI  [project net ADC_SPI_MOSI]
SPI3_NSS: U2.77(PA15) ; port ADC_CS  [project net ADC_CS]
SPI3_SCK: U2.89(PB3) ; port ADC_CLK  [project net ADC_CLK]
STAT1: U2.15(PC0) ; port STAT1
STAT2: U2.17(PC2) ; port STAT2
SWCLK: D2.2(K) P1.4 U2.76(PA14)
SWDIO: D1.2(K) P1.3 U2.72(PA13)
TPIC_DATA: U2.33(PC4) ; port TPIC_DATA
TPIC_RCK: U2.35(PB0) ; port TPIC_RCK
TPIC_SRCK: U2.36(PB1) ; port TPIC_SRCK
TPIC_SRCLR: U2.34(PC5) ; port TPIC_SRCLR
UART5_RX: P17.2 U2.83(PD2)
UART5_TX: P17.1 U2.80(PC12)
USART1_RX: P14#2.2 U2.69(PA10)
USART1_TX: P14#2.1 U2.68(PA9)
USART2_RX: U2.26(PA3) ; port 232_RXD_MCU
USART2_TX: U2.25(PA2) ; port 232_TXD_MCU
NetBAT1_1: BAT1.1 U4.14(Vbat)
NetD3_1: D3.1(A) Q5.C SU1.1(A)
NetLED5_1: LED5.1(K) U2.86(PD5)
NetLED5_2: LED5.2(A) R15.1
NetQ5_B: Q5.B R17.1
NetU2_95: U2.95(PB8) ; port MCU_DAC_LATCH
NetU2_96: U2.96(PB9) ; port MCU_DAC_CLEAR
NetU2_97: U2.97(PE0) ; port MCU_DAC_FAULT

Not connected (* = marked no-connect by the designer): U2 6(VBAT) 12(OSC_IN) 13(OSC_OUT) 18(PC3)* 24(PA1)* 37(PB2)* 38(PE7)* 39(PE8)* 40(PE9)* 41(PE10)* 42(PE11)* 43(PE12)* 44(PE13)* 46(PE15)* 57(PD10)* 60(PD13)* 61(PD14)* 73(NC) 81(PD0)* 82(PD1)* 84(PD3)* 85(PD4)* 87(PD6)* 88(PD7)* 98(PE1)*; U4 1(32KHZ) 4(~{RST})

### Notes on the sheet
- 电池

### Library data of the parts
BAT1 = MHDR1X2: Header, 2-Pin; LatestRevisionDate: 17-Jul-2002; LatestRevisionNote: Re-released for DXP Platform.; Publisher: Altium Limited
C1 = Cap Pol1: Polarized Capacitor (Radial); Published: 8-Jun-2000; LatestRevisionDate: 17-Jul-2002; LatestRevisionNote: Re-released for DXP Platform.; PackageReference: RB7.6-15; Publisher: Altium Limited; PackageDescription: Polarized Capacitor (Radial); 2 Leads
C2 C4 C7-C20 = 无极电容: Value: 104, 16V; Type: 贴片电容
C6 = CAP: Capacitor; Fitted: True
D1 D2 = D Zener: Zener Diode; Published: 8-Jun-2000; LatestRevisionDate: 17-Jul-2002; LatestRevisionNote: Re-released for DXP Platform.; PackageReference: DIODE-0.7; Publisher: Altium Limited; PackageDescription: Diode, Thru-Hole; 2 Leads; 0.7 in Pin Spacing
D3 = D Schottky: Schottky Diode; Published: 8-Jun-2000; LatestRevisionDate: 17-Jul-2002; LatestRevisionNote: Re-released for DXP Platform.; PackageReference: SMB; Publisher: Altium Limited; PackageDescription: DO-214-AA/SMB; 2 C-Bend Leads; Body 5.3 x 3.6 mm, inc. leads (LxW); Code_JEDEC: DO-214-AA
FB1 = 电阻: Type: 贴片电阻
LED5 = LED0603: Typical INFRARED GaAs LED
P1 P14#2 P17 = Header 4: Header, 4-Pin; LatestRevisionDate: 17-Jul-2002; LatestRevisionNote: Re-released for DXP Platform.; Publisher: Altium Limited
P19 = Header 7: XH2.54弯脚座子
Q5 = S8050: NPN General Purpose Amplifier; Published: 8-Jun-2000; LatestRevisionDate: 15-Jan-2003; LatestRevisionNote: PCB Footprint 'BCY-W3/D4.7' replaced; DatasheetVersion: 1997; PackageVersion: Sep-1998; PackageReference: TO-92A; Publisher: Altium Limited; PackageDescription: TO, Flat Index; 3 In-Line, Axial Leads; Body Dia. 4.5mm; Leads 0.51 x 0.48 mm (max); ComponentLink1Description: Manufacturer Link; ComponentLink1URL: http://www.fairchildsemi.com/; ComponentLink2Description: Datasheet; ComponentLink2URL: http://www.fairchildsemi.com/ds/2N%2F2N3904.pdf
R4 R18 R20 = 电阻: Value: 10K; Type: 贴片电阻
R15 R19 = 电阻
  R15: Value: 5.1K, 1%; Type: 贴片电阻
R17 = 电阻: Value: 3.3K, 10%; Type: 贴片电阻
S1 = SW-PB: Switch; Published: 24-Mar-1999; LatestRevisionDate: 17-Jul-2002; LatestRevisionNote: Re-released for DXP Platform.; PackageReference: SPST-2; Publisher: Altium Limited; PackageDescription: Switch; 2 Leads
SU1 = Bell: Electrical Bell; Value: HY-5525; Published: 24-Mar-1999; LatestRevisionDate: 17-Jul-2002; LatestRevisionNote: Re-released for DXP Platform.; PackageReference: PIN2; Publisher: Altium Limited; Type: 贴片蜂鸣器
U1 = Core-N720-Base: Core-N720 核心板是由银尔达（yinerda）基于有方 N720 模组推出的高性能， / 小体积嵌入式 4G+GPS 定位核心版，硬件尺寸完全兼容本公司的 2G，Cat1,WIFI 核 / 心板， 最小成本的进项 2G、 4G 切换。 工作环境为-40℃-80℃， 支持 5-12V 供电， / Uart 做了电平转换， 可以直接与 3.3V MCU 使用串口进行通信， 预留 3.3V 高电平 / 复位管教， 方便异常恢复。 支持标准固件 AT 固件,支持功能电话语音、 短信、 / TCP&UDP、 、 NTP、 HTTP、 FTP、 MQTT、 直连阿里 IOT 云平台协议； 支持 GPS、 Beidou、 / GLONASS 定位功能。
U2 = STM32F103VX
U3 = Header 6: Header, 6-Pin; LatestRevisionDate: 17-Jul-2002; LatestRevisionNote: Re-released for DXP Platform.; Publisher: Altium Limited
U4 = DS3231SN#: 高精度、I2C接口、集成RTC/TCXO/晶体
U5 = MB85RC16V: name: 集成模块（SMD）

## Sheet relayOut.SchDoc
size A4
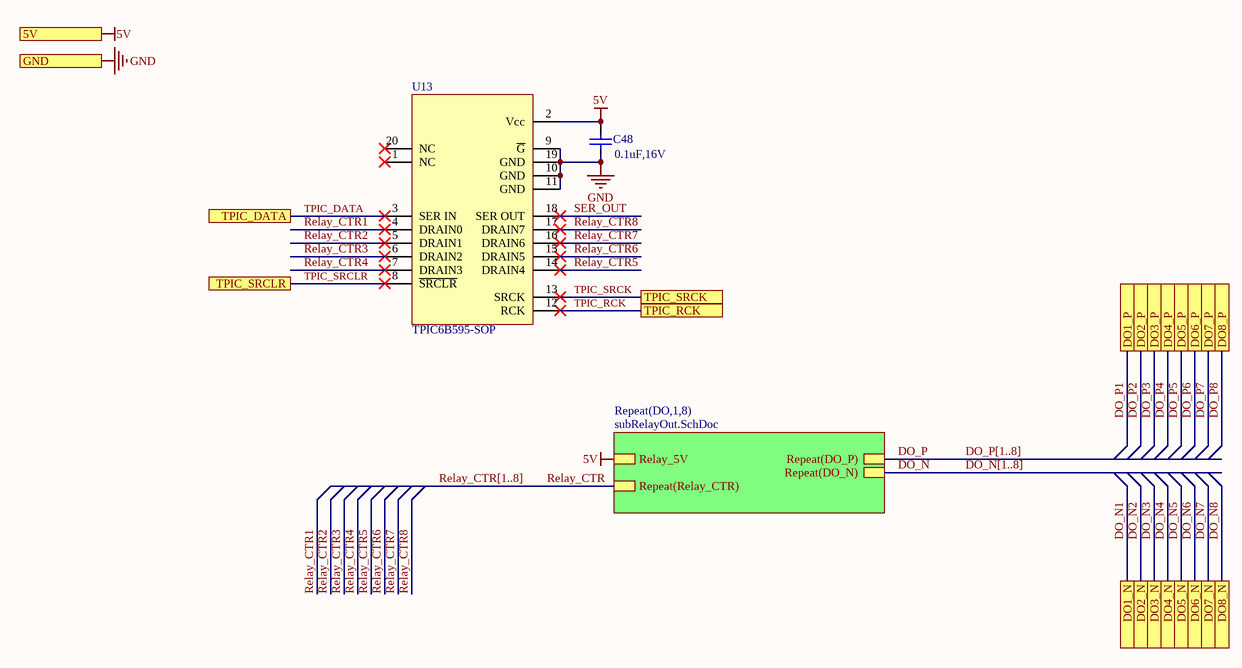
[diagram p9: relayOut.SchDoc]

### Parts
C48  0.1uF,16V  [C0603]
U13  TPIC6B595-SOP  [TPIC6B595]

### Sub-sheets
Repeat(DO,1,8) = subRelayOut.SchDoc: Repeat(DO_P), Repeat(DO_N), Relay_5V, Repeat(Relay_CTR)

### Ports
5V, DO1_N, DO1_P, DO2_N, DO2_P, DO3_N, DO3_P, DO4_N, DO4_P, DO5_N, DO5_P, DO6_N, DO6_P, DO7_N, DO7_P, DO8_N, DO8_P, GND, TPIC_DATA, TPIC_RCK, TPIC_SRCK, TPIC_SRCLR

### Nets
5V: C48.2 U13.2(Vcc) ; port 5V, sheet Repeat(DO,1,8)/Relay_5V
GND: C48.1 U13.9(~{G}) U13.10(GND) U13.11(GND) U13.19(GND) ; port GND
DO_N: sheet Repeat(DO,1,8)/Repeat(DO_N)
DO_P: sheet Repeat(DO,1,8)/Repeat(DO_P)
Relay_CTR: sheet Repeat(DO,1,8)/Repeat(Relay_CTR)
Relay_CTR1: U13.4(DRAIN0)
Relay_CTR2: U13.5(DRAIN1)
Relay_CTR3: U13.6(DRAIN2)
Relay_CTR4: U13.7(DRAIN3)
Relay_CTR5: U13.14(DRAIN4)
Relay_CTR6: U13.15(DRAIN5)
Relay_CTR7: U13.16(DRAIN6)
Relay_CTR8: U13.17(DRAIN7)
SER_OUT: U13.18(SER_OUT)
TPIC_DATA: U13.3(SER_IN) ; port TPIC_DATA
TPIC_RCK: U13.12(RCK) ; port TPIC_RCK
TPIC_SRCK: U13.13(SRCK) ; port TPIC_SRCK
TPIC_SRCLR: U13.8(~{SRCLR}) ; port TPIC_SRCLR

Not connected (* = marked no-connect by the designer): U13 1(NC)* 20(NC)*

### Buses and harness runs
bus DO_N[1..8]
bus DO_P[1..8]
bus Relay_CTR[1..8]

### Library data of the parts
C48 = 无极电容: Type: 贴片电容; Value: 0.1uF,16V
U13 = TPIC6B595: name: 集成模块（SMD）

## Sheet subRelayOut.SchDoc
size A4
Used 8 times, as channels U_relayOut/DO1, U_relayOut/DO2, U_relayOut/DO3, U_relayOut/DO4, U_relayOut/DO5, U_relayOut/DO6, U_relayOut/DO7, U_relayOut/DO8. Parts and nets are listed once, with the designators drawn on the sheet.
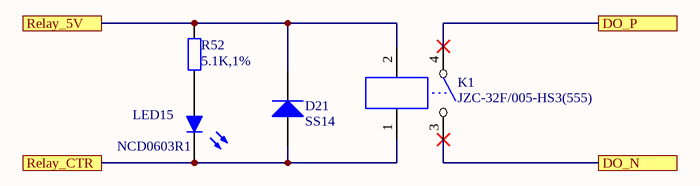
[diagram p10: subRelayOut.SchDoc]

### Parts
D21  SS14  [SMA_L4.4-W2.8-LS5.4-RD]
K1  JZC-32F/005-HS3(555)  [RELAY-TH_JZC-32F-XXXHXX]
LED15  NCD0603R1  [LED0603-RD]
R52  5.1K,1%  [R0603]

### Ports
DO_N, DO_P, Relay_5V, Relay_CTR

### Nets
DO_N: K1.3 ; port DO_N
DO_P: K1.4 ; port DO_P
Relay_5V: D21.2(K) K1.2 R52.1 ; port Relay_5V
Relay_CTR: D21.1(A) K1.1 LED15.1(K) ; port Relay_CTR
NetLED15_2: LED15.2(A) R52.2

### Channels
U_relayOut/DO1: designators end in _DO1; ports DO_N=DO_N1 DO_P=DO_P1 Relay_5V=5V Relay_CTR=Relay_CTR1
U_relayOut/DO2: designators end in _DO2; ports DO_N=DO_N2 DO_P=DO_P2 Relay_5V=5V Relay_CTR=Relay_CTR2
U_relayOut/DO3: designators end in _DO3; ports DO_N=DO_N3 DO_P=DO_P3 Relay_5V=5V Relay_CTR=Relay_CTR3
U_relayOut/DO4: designators end in _DO4; ports DO_N=DO_N4 DO_P=DO_P4 Relay_5V=5V Relay_CTR=Relay_CTR4
U_relayOut/DO5: designators end in _DO5; ports DO_N=DO_N5 DO_P=DO_P5 Relay_5V=5V Relay_CTR=Relay_CTR5
U_relayOut/DO6: designators end in _DO6; ports DO_N=DO_N6 DO_P=DO_P6 Relay_5V=5V Relay_CTR=Relay_CTR6
U_relayOut/DO7: designators end in _DO7; ports DO_N=DO_N7 DO_P=DO_P7 Relay_5V=5V Relay_CTR=Relay_CTR7
U_relayOut/DO8: designators end in _DO8; ports DO_N=DO_N8 DO_P=DO_P8 Relay_5V=5V Relay_CTR=Relay_CTR8

### Library data of the parts
D21 = Diode: Default Diode; Published: 8-Jun-2000; LatestRevisionDate: 17-Jul-2002; LatestRevisionNote: Re-released for DXP Platform.; PackageVersion: Sep-1996; PackageReference: SMC; Publisher: Altium Limited; PackageDescription: DO-214-AB/SMC; 2 C-Bend Leads; Body 7.9 x 5.9 mm, inc. leads (LxW); Code_JEDEC: DO-214-AB
LED15 = LED0603: Typical INFRARED GaAs LED
R52 = 电阻: Value: 5.1K, 1%; Type: 贴片电阻

## Sheet myPLC.SchDoc
size A4
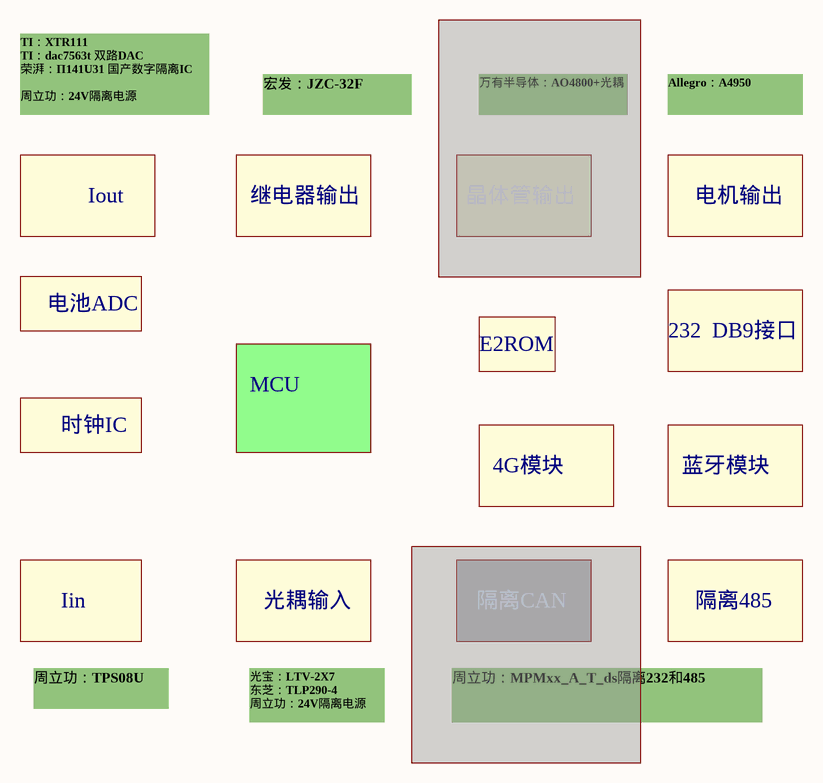
[diagram p11: myPLC.SchDoc]

### Notes on the sheet
- TI：XTR111
  TI：dac7563t 双路DAC
  荣湃：Π141U31 国产数字隔离IC
  周立功：24V隔离电源
- 宏发：JZC-32F
- 万有半导体：AO4800+光耦
- Allegro：A4950
- Iout
- 继电器输出
- 晶体管输出
- 电机输出
- 电池ADC
- MCU
- E2ROM
- 232  DB9接口
- 时钟IC
- 4G模块
- 蓝牙模块
- Iin
- 光耦输入
- 隔离CAN
- 隔离485
- 周立功：TPS08U
- 光宝：LTV-2X7
  东芝：TLP290-4
  周立功：24V隔离电源
- 周立功：MPMxx_A_T_ds隔离232和485